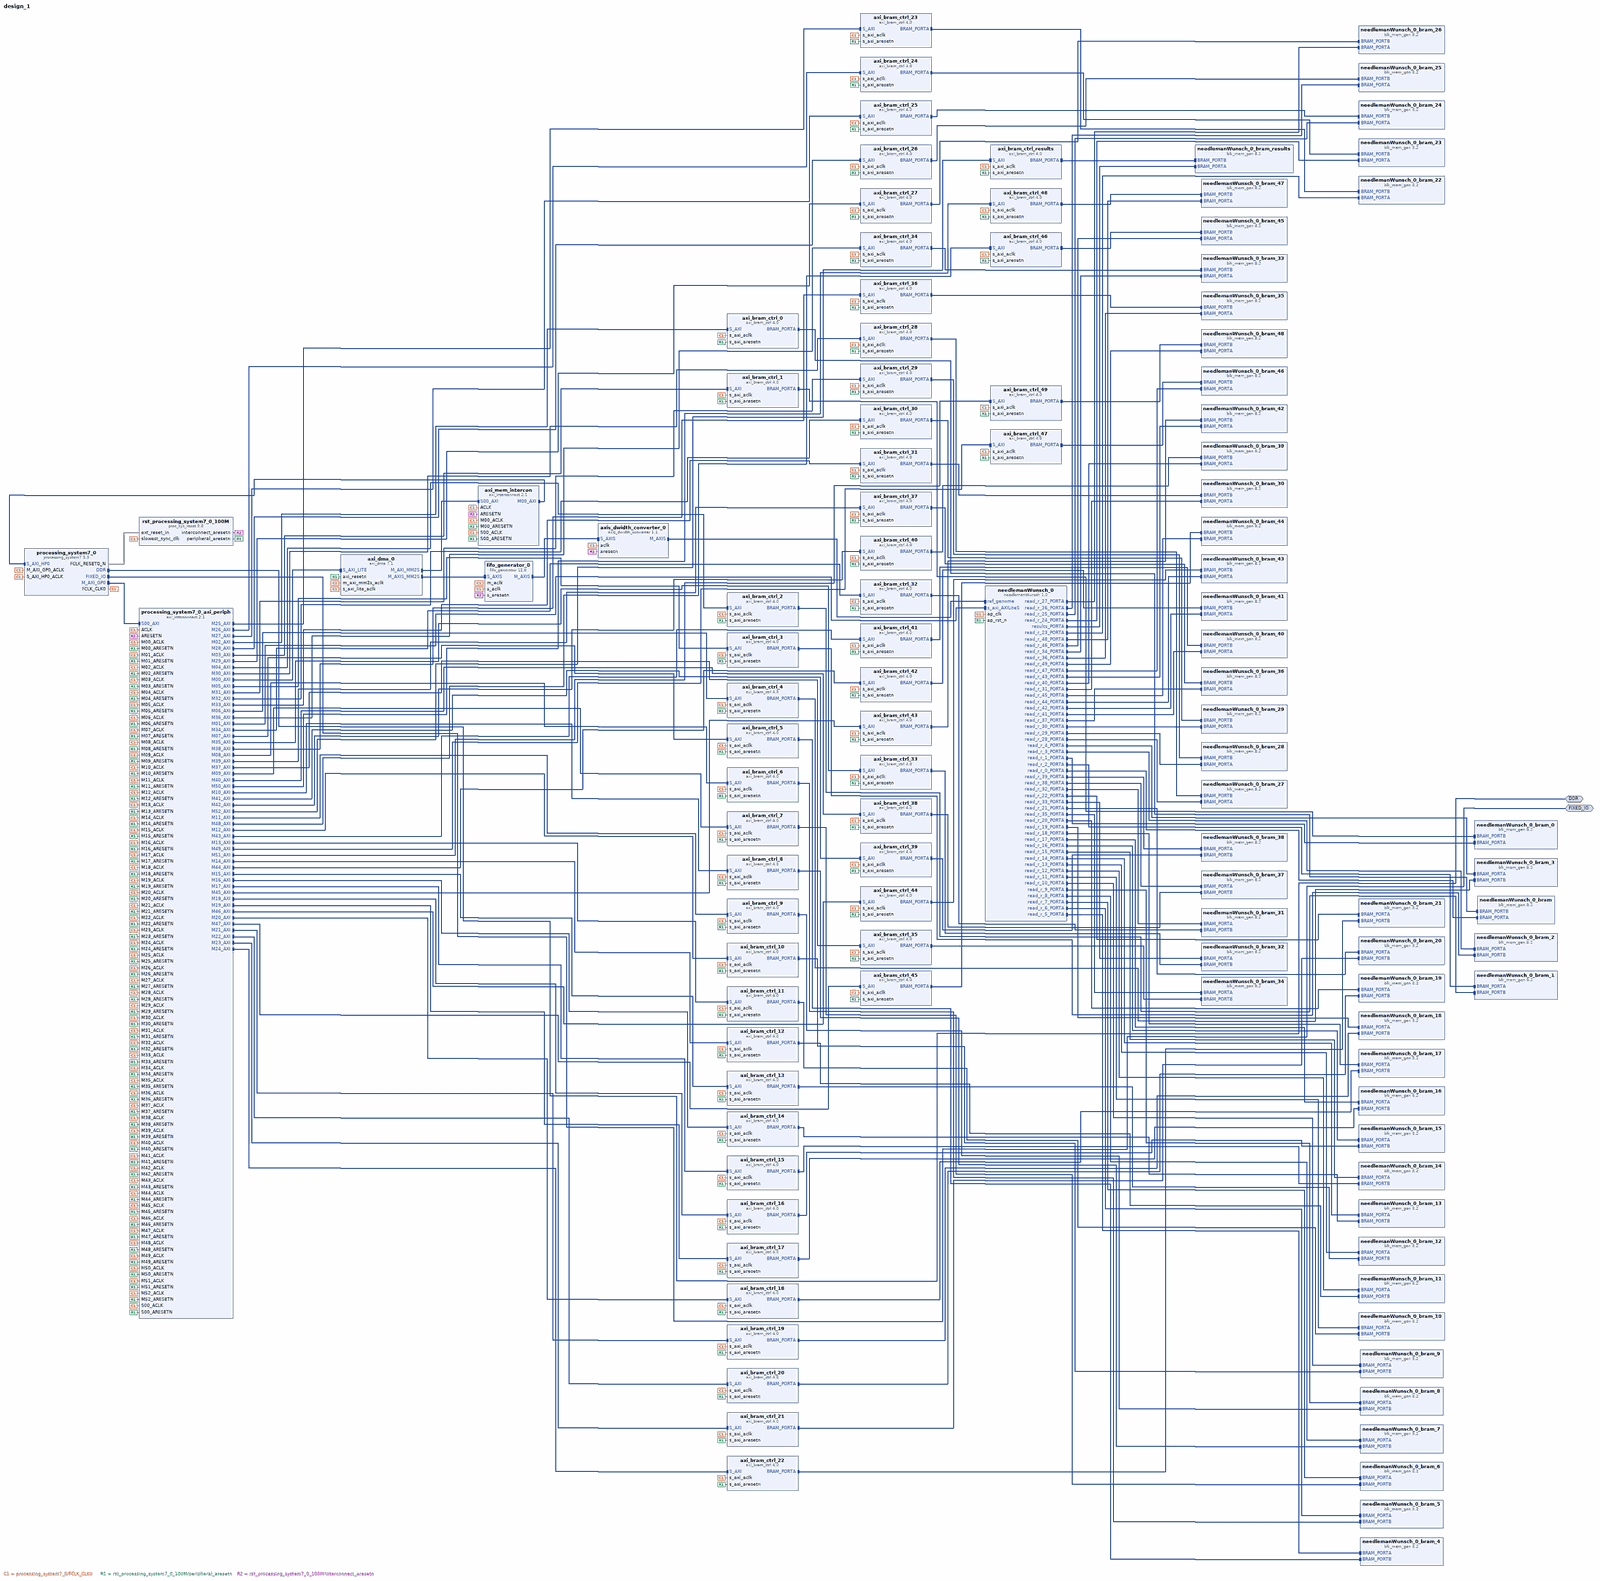
[diagram p0: block diagram of the top level, whole]
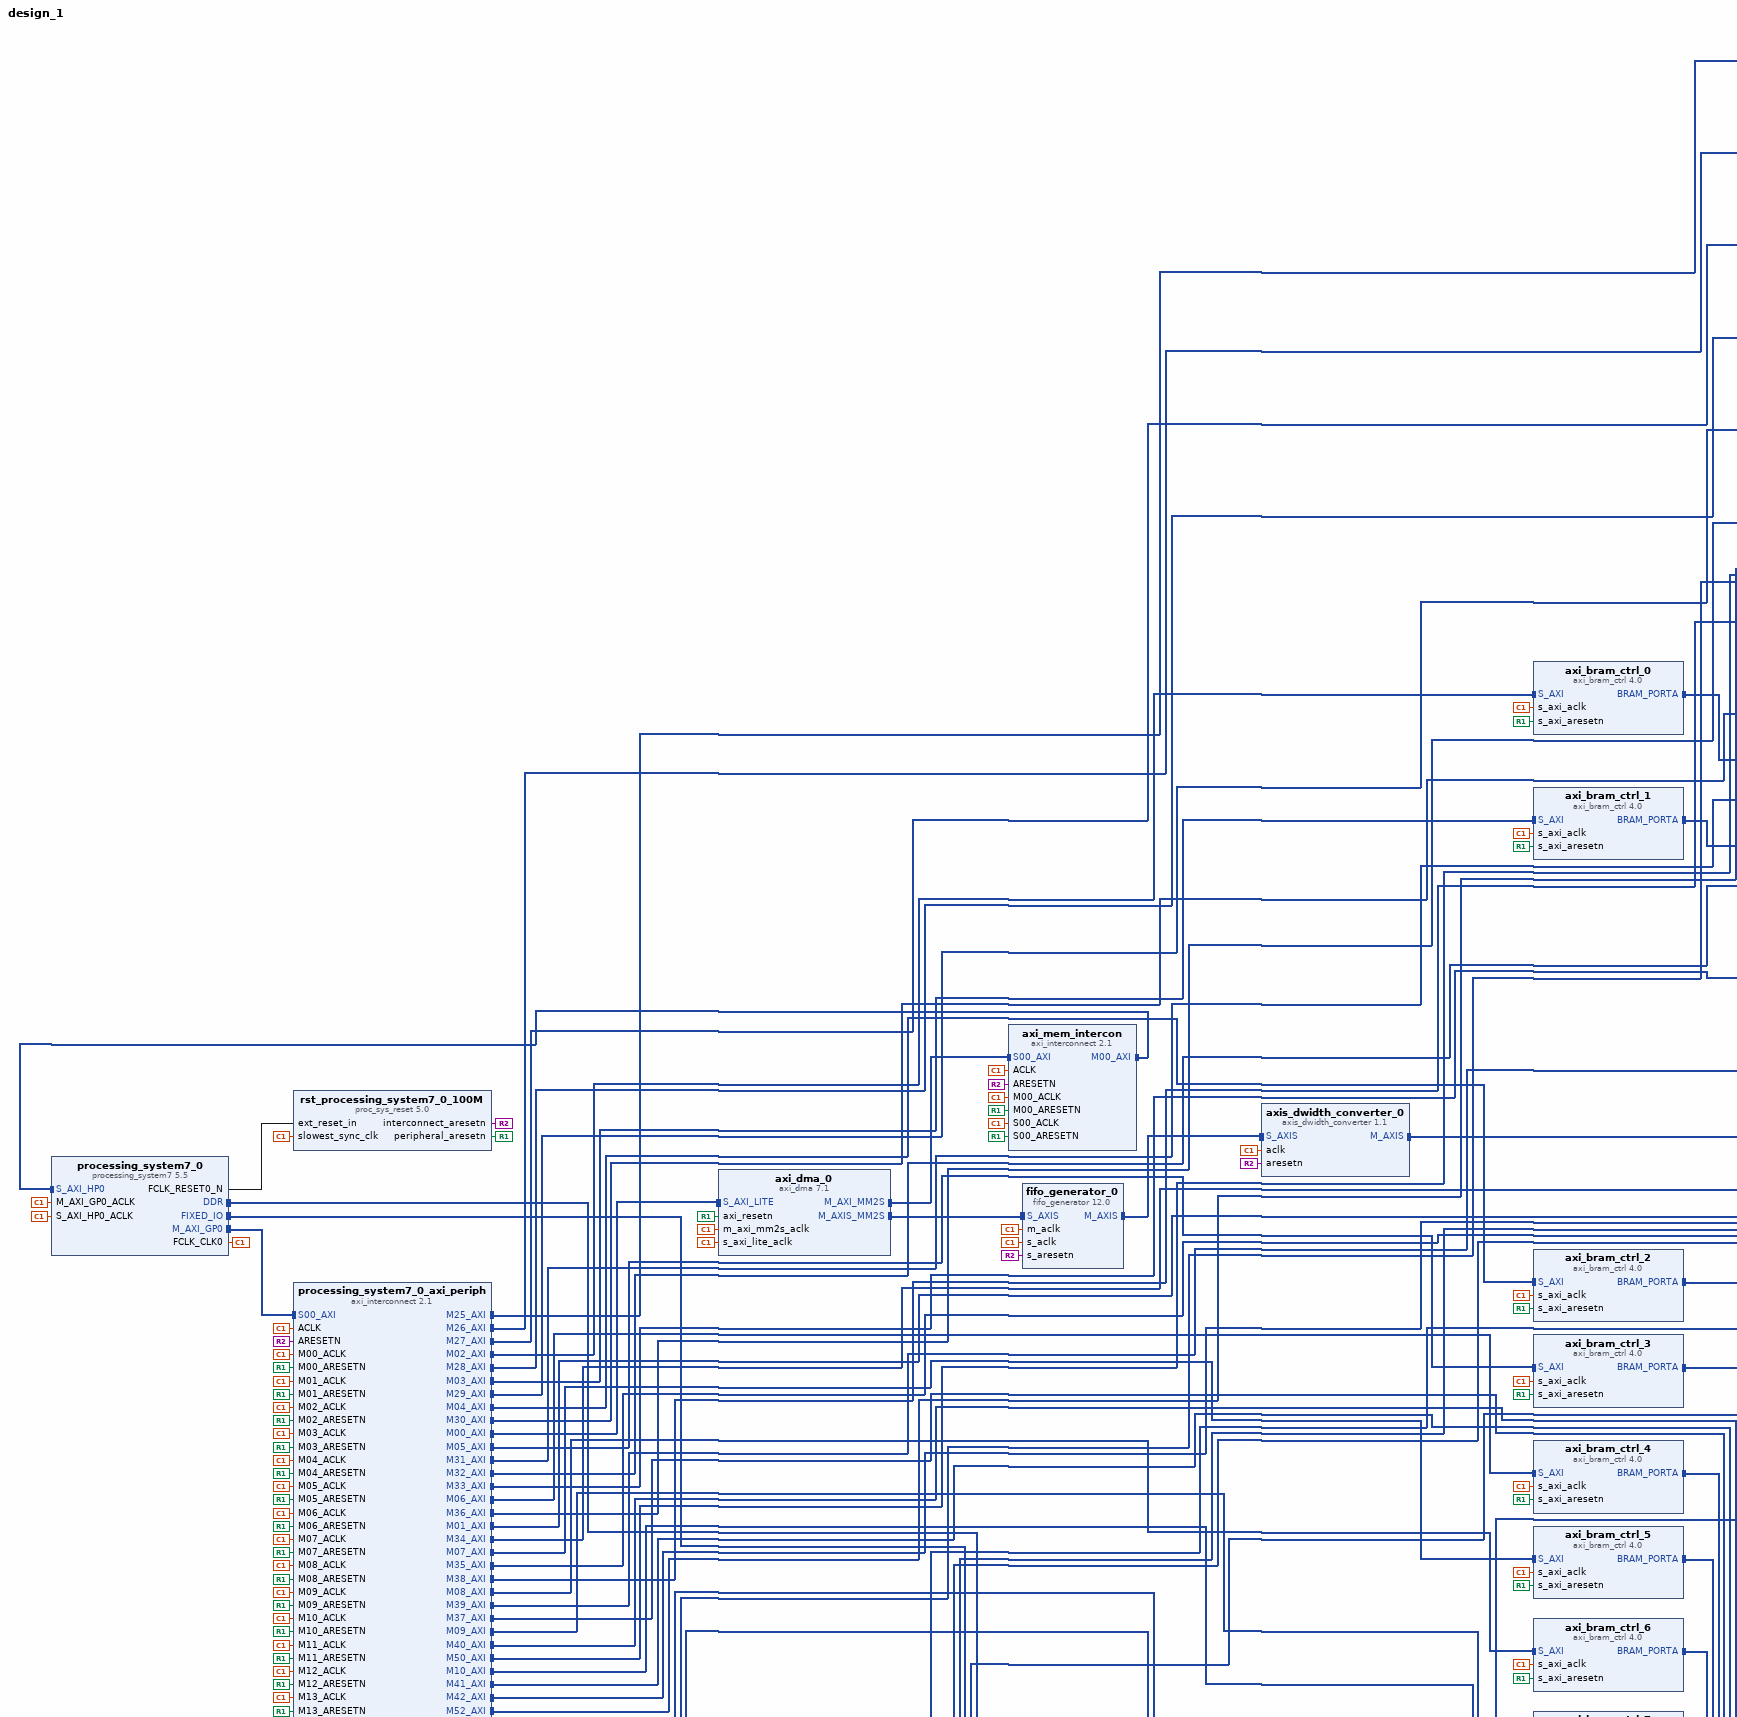
[diagram p1: block diagram of the top level, upper left part]
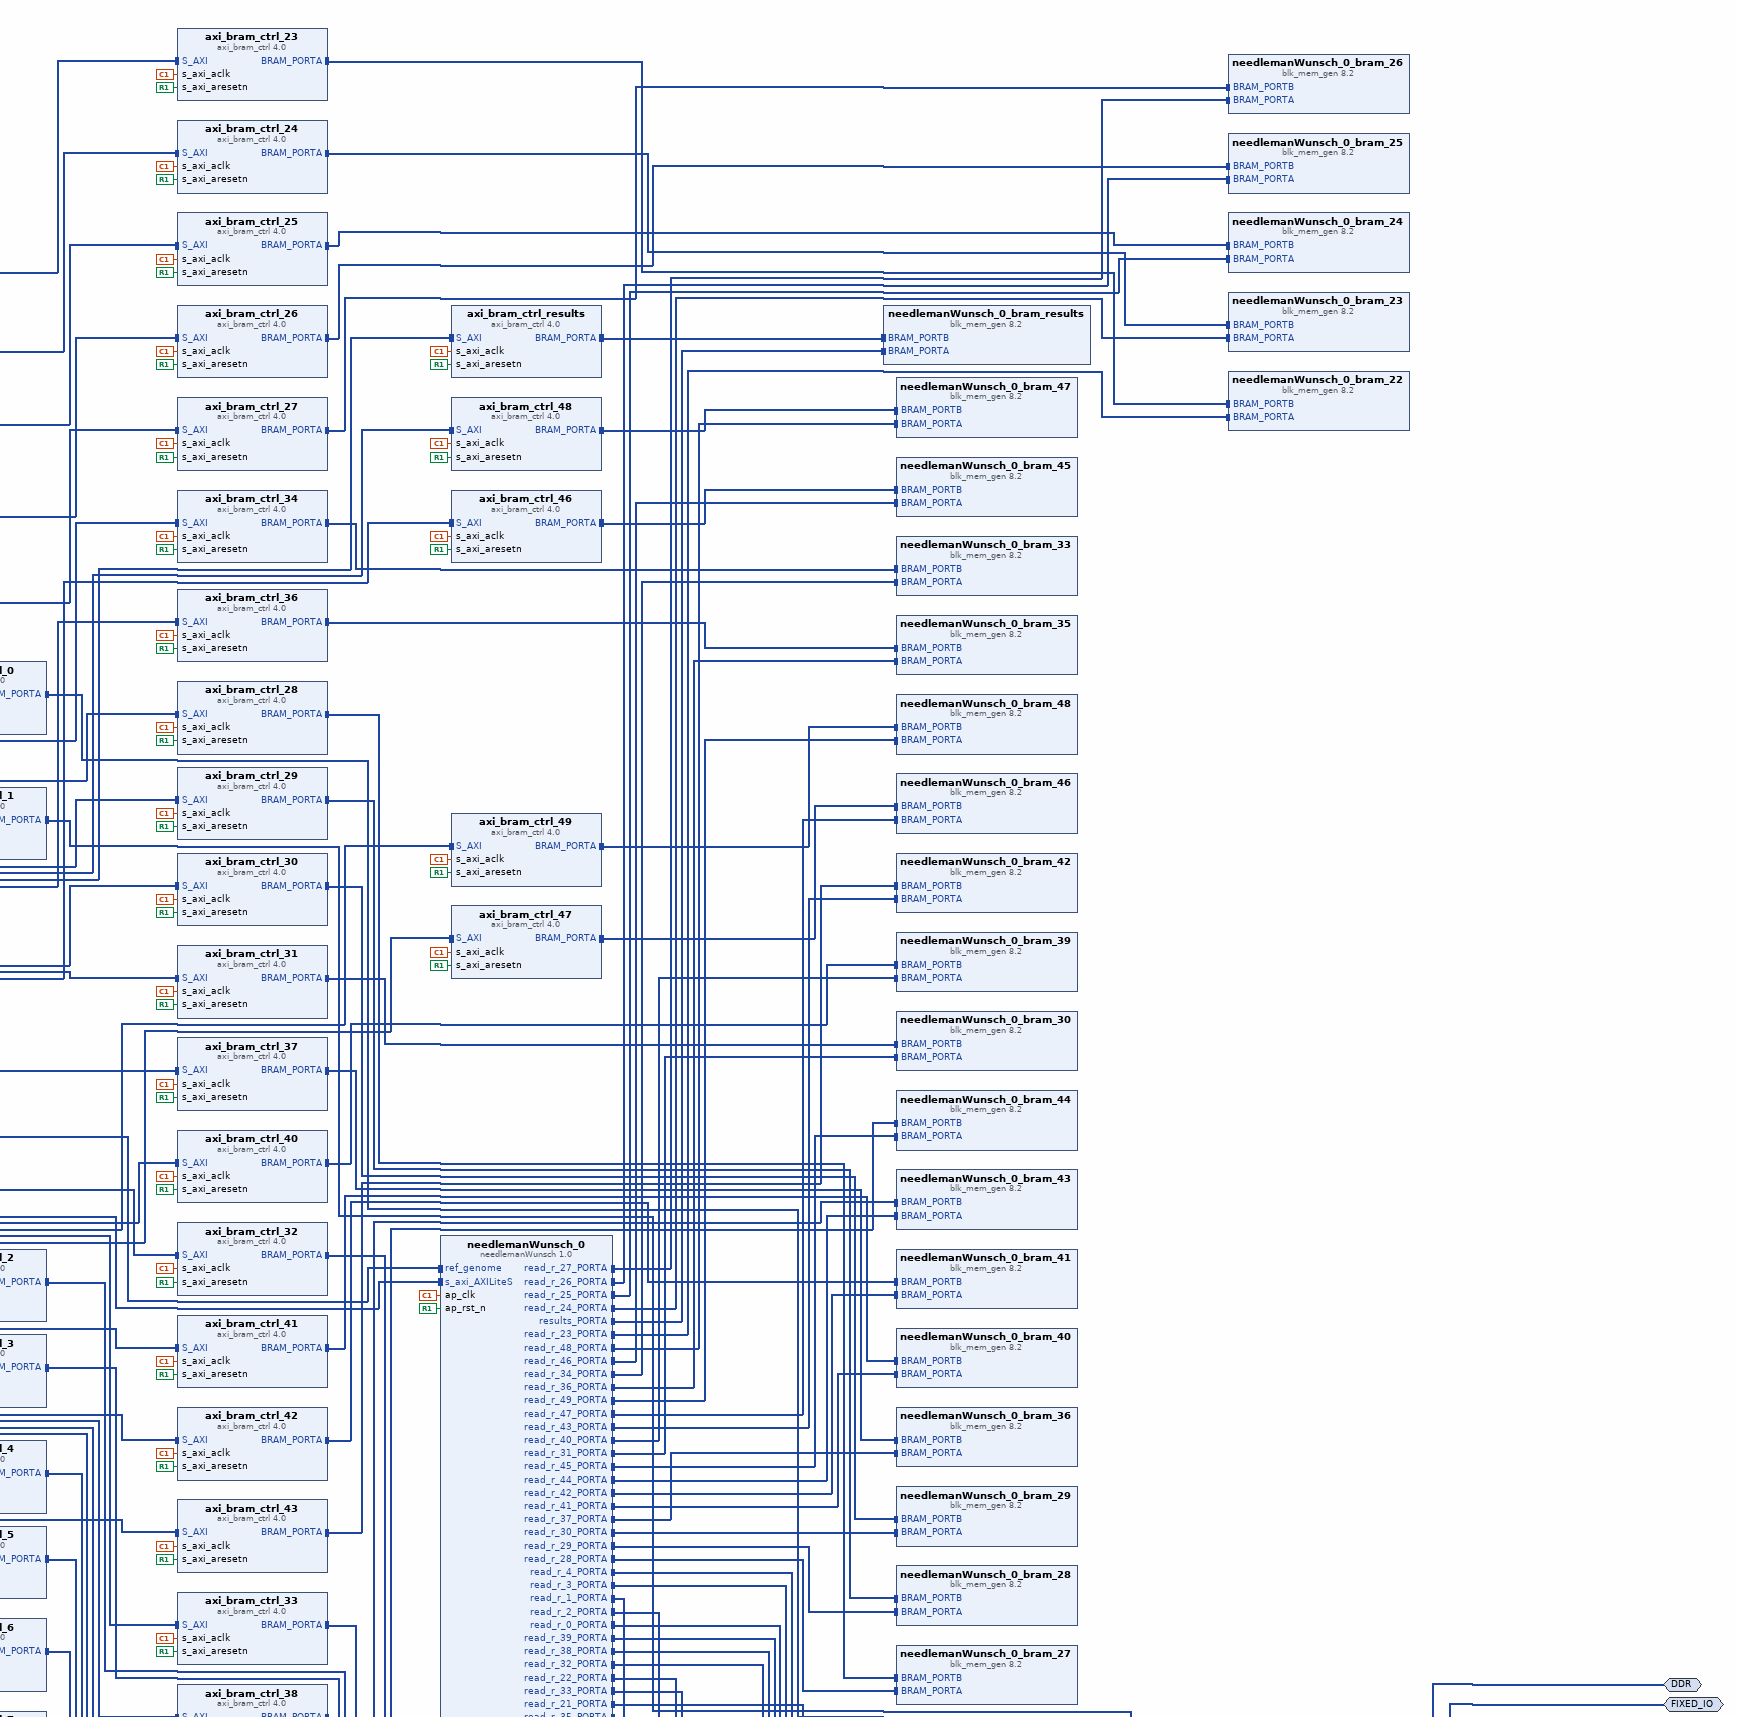
[diagram p2: block diagram of the top level, upper right part]
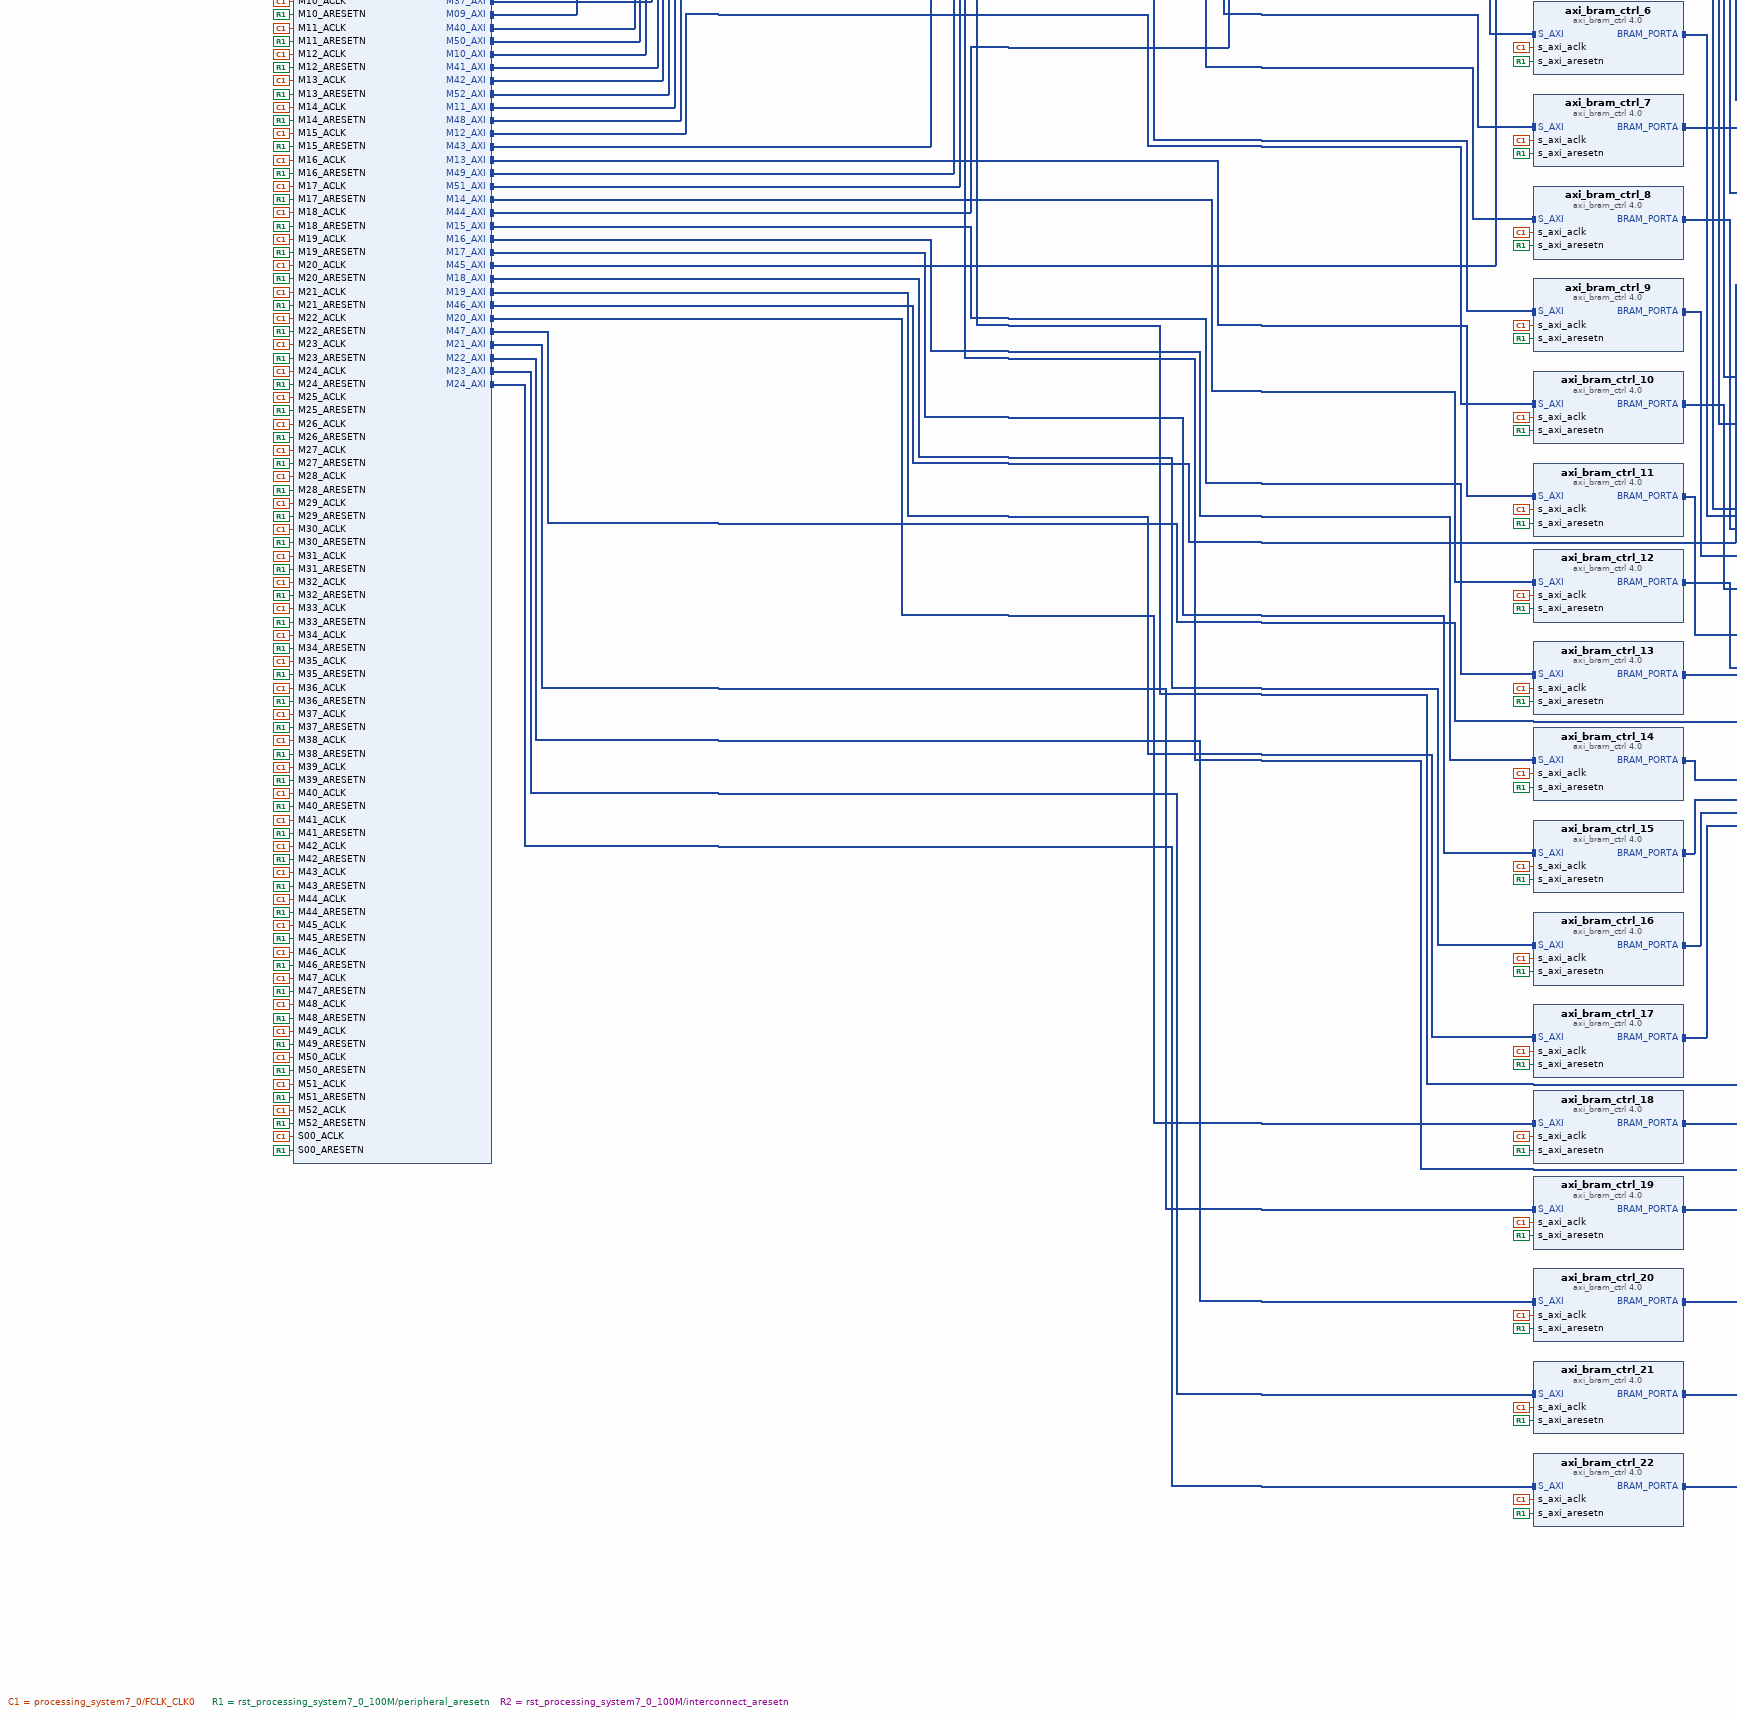
[diagram p3: block diagram of the top level, lower left part]
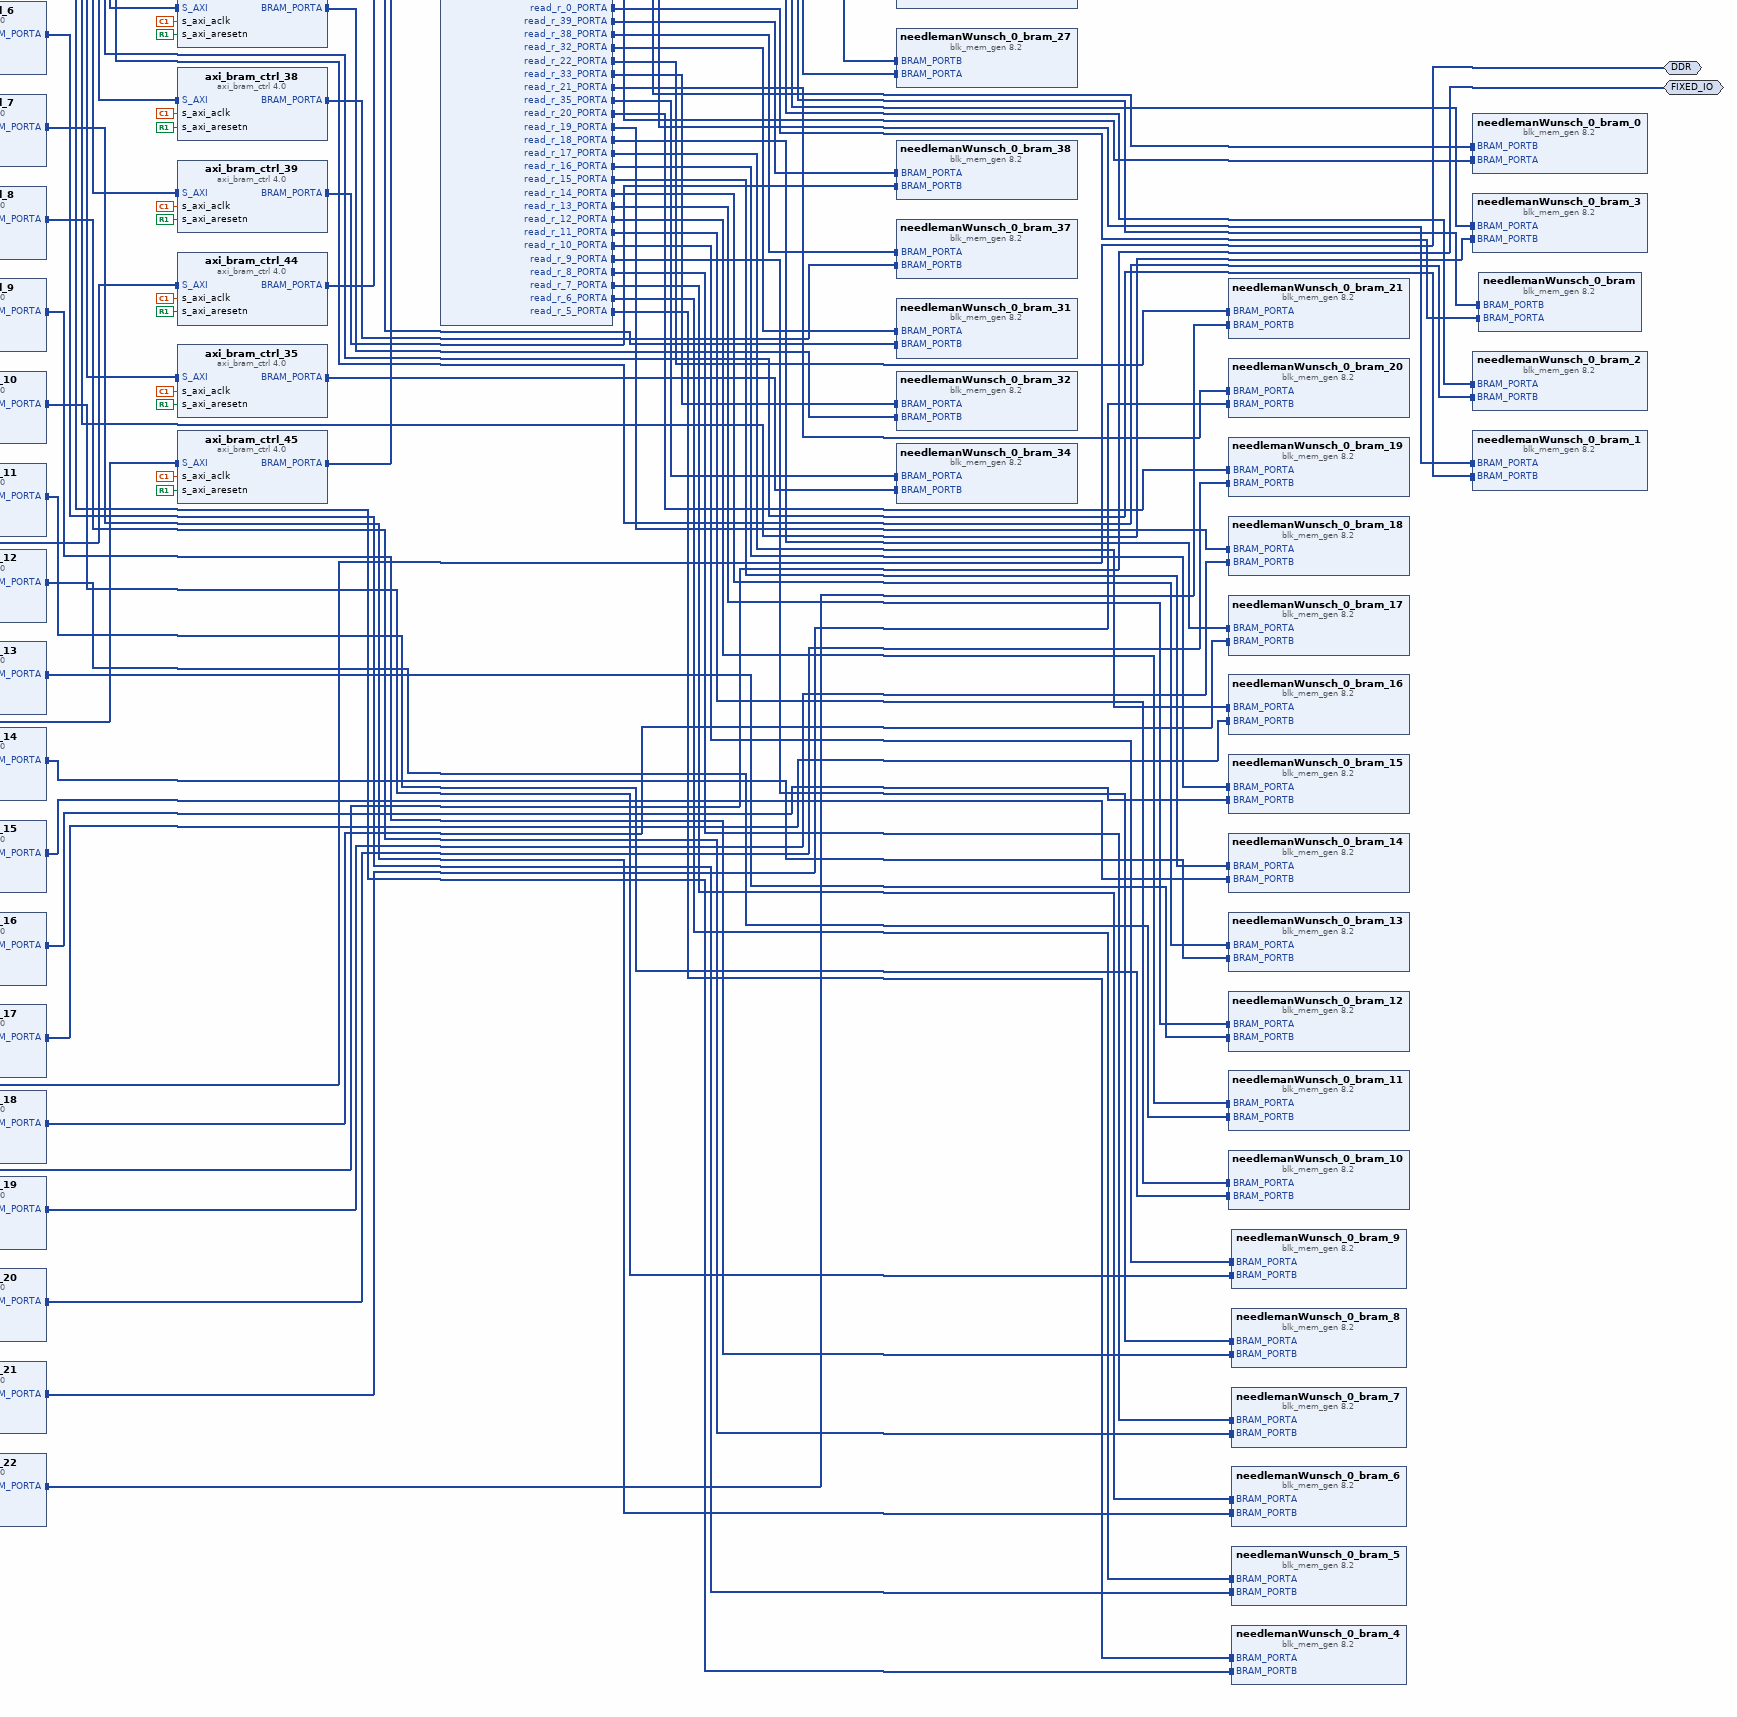
[diagram p4: block diagram of the top level, lower right part]
# Vivado block design design_1, Vivado 2015.2
create_bd_design design_1

create_bd_intf_port -mode Master -vlnv xilinx.com:interface:ddrx_rtl:1.0 DDR
create_bd_intf_port -mode Master -vlnv xilinx.com:display_processing_system7:fixedio_rtl:1.0 FIXED_IO

create_bd_cell -type ip -vlnv xilinx.com:ip:processing_system7:5.5 processing_system7_0
set_property -dict [list \
  CONFIG.PCW_FPGA1_PERIPHERAL_FREQMHZ 200 \
  CONFIG.PCW_USE_S_AXI_HP0 1 \
  CONFIG.PCW_EN_CLK1_PORT 1 \
  CONFIG.preset ZedBoard \
] [get_bd_cells processing_system7_0]
create_bd_cell -type ip -vlnv xilinx.com:ip:axi_dma:7.1 axi_dma_0
set_property -dict [list \
  CONFIG.c_include_sg 0 \
  CONFIG.c_sg_length_width 18 \
  CONFIG.c_m_axi_mm2s_data_width 64 \
  CONFIG.c_m_axis_mm2s_tdata_width 64 \
  CONFIG.c_mm2s_burst_size 8 \
  CONFIG.c_include_s2mm 0 \
] [get_bd_cells axi_dma_0]
create_bd_cell -type ip -vlnv xilinx.com:ip:fifo_generator:12.0 fifo_generator_0
set_property -dict [list \
  CONFIG.INTERFACE_TYPE AXI_STREAM \
  CONFIG.Clock_Type_AXI Independent_Clock \
  CONFIG.TDATA_NUM_BYTES 8 \
  CONFIG.TUSER_WIDTH 0 \
  CONFIG.FIFO_Implementation_wach Independent_Clocks_Distributed_RAM \
  CONFIG.FIFO_Implementation_wdch Independent_Clocks_Block_RAM \
  CONFIG.FIFO_Implementation_wrch Independent_Clocks_Distributed_RAM \
  CONFIG.FIFO_Implementation_rach Independent_Clocks_Distributed_RAM \
  CONFIG.FIFO_Implementation_rdch Independent_Clocks_Block_RAM \
  CONFIG.FIFO_Implementation_axis Independent_Clocks_Block_RAM \
] [get_bd_cells fifo_generator_0]
create_bd_cell -type ip -vlnv xilinx.com:ip:axis_dwidth_converter:1.1 axis_dwidth_converter_0
set_property -dict {CONFIG.M_TDATA_NUM_BYTES 1} [get_bd_cells axis_dwidth_converter_0]
create_bd_cell -type ip -vlnv xilinx.com:ip:axi_interconnect:2.1 axi_mem_intercon
set_property -dict {CONFIG.NUM_MI 1} [get_bd_cells axi_mem_intercon]
create_bd_cell -type ip -vlnv xilinx.com:ip:proc_sys_reset:5.0 rst_processing_system7_0_100M
create_bd_cell -type ip -vlnv xilinx.com:ip:axi_interconnect:2.1 processing_system7_0_axi_periph
set_property -dict {CONFIG.NUM_MI 53} [get_bd_cells processing_system7_0_axi_periph]
create_bd_cell -type ip -vlnv xilinx.com:ip:blk_mem_gen:8.2 needlemanWunsch_0_bram
set_property -dict [list \
  CONFIG.Memory_Type True_Dual_Port_RAM \
  CONFIG.Enable_B Use_ENB_Pin \
  CONFIG.Use_RSTB_Pin true \
  CONFIG.Port_B_Clock 100 \
  CONFIG.Port_B_Write_Rate 50 \
  CONFIG.Port_B_Enable_Rate 100 \
] [get_bd_cells needlemanWunsch_0_bram]
create_bd_cell -type ip -vlnv xilinx.com:ip:blk_mem_gen:8.2 needlemanWunsch_0_bram_0
set_property -dict [list \
  CONFIG.Memory_Type True_Dual_Port_RAM \
  CONFIG.Enable_B Use_ENB_Pin \
  CONFIG.Use_RSTB_Pin true \
  CONFIG.Port_B_Clock 100 \
  CONFIG.Port_B_Write_Rate 50 \
  CONFIG.Port_B_Enable_Rate 100 \
] [get_bd_cells needlemanWunsch_0_bram_0]
create_bd_cell -type ip -vlnv xilinx.com:ip:blk_mem_gen:8.2 needlemanWunsch_0_bram_1
set_property -dict [list \
  CONFIG.Memory_Type True_Dual_Port_RAM \
  CONFIG.Enable_B Use_ENB_Pin \
  CONFIG.Use_RSTB_Pin true \
  CONFIG.Port_B_Clock 100 \
  CONFIG.Port_B_Write_Rate 50 \
  CONFIG.Port_B_Enable_Rate 100 \
] [get_bd_cells needlemanWunsch_0_bram_1]
create_bd_cell -type ip -vlnv xilinx.com:ip:blk_mem_gen:8.2 needlemanWunsch_0_bram_2
set_property -dict [list \
  CONFIG.Memory_Type True_Dual_Port_RAM \
  CONFIG.Enable_B Use_ENB_Pin \
  CONFIG.Use_RSTB_Pin true \
  CONFIG.Port_B_Clock 100 \
  CONFIG.Port_B_Write_Rate 50 \
  CONFIG.Port_B_Enable_Rate 100 \
] [get_bd_cells needlemanWunsch_0_bram_2]
create_bd_cell -type ip -vlnv xilinx.com:ip:blk_mem_gen:8.2 needlemanWunsch_0_bram_3
set_property -dict [list \
  CONFIG.Memory_Type True_Dual_Port_RAM \
  CONFIG.Enable_B Use_ENB_Pin \
  CONFIG.Use_RSTB_Pin true \
  CONFIG.Port_B_Clock 100 \
  CONFIG.Port_B_Write_Rate 50 \
  CONFIG.Port_B_Enable_Rate 100 \
] [get_bd_cells needlemanWunsch_0_bram_3]
create_bd_cell -type ip -vlnv xilinx.com:ip:blk_mem_gen:8.2 needlemanWunsch_0_bram_4
set_property -dict [list \
  CONFIG.Memory_Type True_Dual_Port_RAM \
  CONFIG.Enable_B Use_ENB_Pin \
  CONFIG.Use_RSTB_Pin true \
  CONFIG.Port_B_Clock 100 \
  CONFIG.Port_B_Write_Rate 50 \
  CONFIG.Port_B_Enable_Rate 100 \
] [get_bd_cells needlemanWunsch_0_bram_4]
create_bd_cell -type ip -vlnv xilinx.com:ip:blk_mem_gen:8.2 needlemanWunsch_0_bram_5
set_property -dict [list \
  CONFIG.Memory_Type True_Dual_Port_RAM \
  CONFIG.Enable_B Use_ENB_Pin \
  CONFIG.Use_RSTB_Pin true \
  CONFIG.Port_B_Clock 100 \
  CONFIG.Port_B_Write_Rate 50 \
  CONFIG.Port_B_Enable_Rate 100 \
] [get_bd_cells needlemanWunsch_0_bram_5]
create_bd_cell -type ip -vlnv xilinx.com:ip:blk_mem_gen:8.2 needlemanWunsch_0_bram_6
set_property -dict [list \
  CONFIG.Memory_Type True_Dual_Port_RAM \
  CONFIG.Enable_B Use_ENB_Pin \
  CONFIG.Use_RSTB_Pin true \
  CONFIG.Port_B_Clock 100 \
  CONFIG.Port_B_Write_Rate 50 \
  CONFIG.Port_B_Enable_Rate 100 \
] [get_bd_cells needlemanWunsch_0_bram_6]
create_bd_cell -type ip -vlnv xilinx.com:ip:blk_mem_gen:8.2 needlemanWunsch_0_bram_7
set_property -dict [list \
  CONFIG.Memory_Type True_Dual_Port_RAM \
  CONFIG.Enable_B Use_ENB_Pin \
  CONFIG.Use_RSTB_Pin true \
  CONFIG.Port_B_Clock 100 \
  CONFIG.Port_B_Write_Rate 50 \
  CONFIG.Port_B_Enable_Rate 100 \
] [get_bd_cells needlemanWunsch_0_bram_7]
create_bd_cell -type ip -vlnv xilinx.com:ip:blk_mem_gen:8.2 needlemanWunsch_0_bram_8
set_property -dict [list \
  CONFIG.Memory_Type True_Dual_Port_RAM \
  CONFIG.Enable_B Use_ENB_Pin \
  CONFIG.Use_RSTB_Pin true \
  CONFIG.Port_B_Clock 100 \
  CONFIG.Port_B_Write_Rate 50 \
  CONFIG.Port_B_Enable_Rate 100 \
] [get_bd_cells needlemanWunsch_0_bram_8]
create_bd_cell -type ip -vlnv xilinx.com:ip:blk_mem_gen:8.2 needlemanWunsch_0_bram_9
set_property -dict [list \
  CONFIG.Memory_Type True_Dual_Port_RAM \
  CONFIG.Enable_B Use_ENB_Pin \
  CONFIG.Use_RSTB_Pin true \
  CONFIG.Port_B_Clock 100 \
  CONFIG.Port_B_Write_Rate 50 \
  CONFIG.Port_B_Enable_Rate 100 \
] [get_bd_cells needlemanWunsch_0_bram_9]
create_bd_cell -type ip -vlnv xilinx.com:ip:blk_mem_gen:8.2 needlemanWunsch_0_bram_10
set_property -dict [list \
  CONFIG.Memory_Type True_Dual_Port_RAM \
  CONFIG.Enable_B Use_ENB_Pin \
  CONFIG.Use_RSTB_Pin true \
  CONFIG.Port_B_Clock 100 \
  CONFIG.Port_B_Write_Rate 50 \
  CONFIG.Port_B_Enable_Rate 100 \
] [get_bd_cells needlemanWunsch_0_bram_10]
create_bd_cell -type ip -vlnv xilinx.com:ip:blk_mem_gen:8.2 needlemanWunsch_0_bram_11
set_property -dict [list \
  CONFIG.Memory_Type True_Dual_Port_RAM \
  CONFIG.Enable_B Use_ENB_Pin \
  CONFIG.Use_RSTB_Pin true \
  CONFIG.Port_B_Clock 100 \
  CONFIG.Port_B_Write_Rate 50 \
  CONFIG.Port_B_Enable_Rate 100 \
] [get_bd_cells needlemanWunsch_0_bram_11]
create_bd_cell -type ip -vlnv xilinx.com:ip:blk_mem_gen:8.2 needlemanWunsch_0_bram_12
set_property -dict [list \
  CONFIG.Memory_Type True_Dual_Port_RAM \
  CONFIG.Enable_B Use_ENB_Pin \
  CONFIG.Use_RSTB_Pin true \
  CONFIG.Port_B_Clock 100 \
  CONFIG.Port_B_Write_Rate 50 \
  CONFIG.Port_B_Enable_Rate 100 \
] [get_bd_cells needlemanWunsch_0_bram_12]
create_bd_cell -type ip -vlnv xilinx.com:ip:blk_mem_gen:8.2 needlemanWunsch_0_bram_13
set_property -dict [list \
  CONFIG.Memory_Type True_Dual_Port_RAM \
  CONFIG.Enable_B Use_ENB_Pin \
  CONFIG.Use_RSTB_Pin true \
  CONFIG.Port_B_Clock 100 \
  CONFIG.Port_B_Write_Rate 50 \
  CONFIG.Port_B_Enable_Rate 100 \
] [get_bd_cells needlemanWunsch_0_bram_13]
create_bd_cell -type ip -vlnv xilinx.com:ip:blk_mem_gen:8.2 needlemanWunsch_0_bram_14
set_property -dict [list \
  CONFIG.Memory_Type True_Dual_Port_RAM \
  CONFIG.Enable_B Use_ENB_Pin \
  CONFIG.Use_RSTB_Pin true \
  CONFIG.Port_B_Clock 100 \
  CONFIG.Port_B_Write_Rate 50 \
  CONFIG.Port_B_Enable_Rate 100 \
] [get_bd_cells needlemanWunsch_0_bram_14]
create_bd_cell -type ip -vlnv xilinx.com:ip:blk_mem_gen:8.2 needlemanWunsch_0_bram_15
set_property -dict [list \
  CONFIG.Memory_Type True_Dual_Port_RAM \
  CONFIG.Enable_B Use_ENB_Pin \
  CONFIG.Use_RSTB_Pin true \
  CONFIG.Port_B_Clock 100 \
  CONFIG.Port_B_Write_Rate 50 \
  CONFIG.Port_B_Enable_Rate 100 \
] [get_bd_cells needlemanWunsch_0_bram_15]
create_bd_cell -type ip -vlnv xilinx.com:ip:blk_mem_gen:8.2 needlemanWunsch_0_bram_16
set_property -dict [list \
  CONFIG.Memory_Type True_Dual_Port_RAM \
  CONFIG.Enable_B Use_ENB_Pin \
  CONFIG.Use_RSTB_Pin true \
  CONFIG.Port_B_Clock 100 \
  CONFIG.Port_B_Write_Rate 50 \
  CONFIG.Port_B_Enable_Rate 100 \
] [get_bd_cells needlemanWunsch_0_bram_16]
create_bd_cell -type ip -vlnv xilinx.com:ip:blk_mem_gen:8.2 needlemanWunsch_0_bram_17
set_property -dict [list \
  CONFIG.Memory_Type True_Dual_Port_RAM \
  CONFIG.Enable_B Use_ENB_Pin \
  CONFIG.Use_RSTB_Pin true \
  CONFIG.Port_B_Clock 100 \
  CONFIG.Port_B_Write_Rate 50 \
  CONFIG.Port_B_Enable_Rate 100 \
] [get_bd_cells needlemanWunsch_0_bram_17]
create_bd_cell -type ip -vlnv xilinx.com:ip:blk_mem_gen:8.2 needlemanWunsch_0_bram_18
set_property -dict [list \
  CONFIG.Memory_Type True_Dual_Port_RAM \
  CONFIG.Enable_B Use_ENB_Pin \
  CONFIG.Use_RSTB_Pin true \
  CONFIG.Port_B_Clock 100 \
  CONFIG.Port_B_Write_Rate 50 \
  CONFIG.Port_B_Enable_Rate 100 \
] [get_bd_cells needlemanWunsch_0_bram_18]
create_bd_cell -type ip -vlnv xilinx.com:ip:blk_mem_gen:8.2 needlemanWunsch_0_bram_19
set_property -dict [list \
  CONFIG.Memory_Type True_Dual_Port_RAM \
  CONFIG.Enable_B Use_ENB_Pin \
  CONFIG.Use_RSTB_Pin true \
  CONFIG.Port_B_Clock 100 \
  CONFIG.Port_B_Write_Rate 50 \
  CONFIG.Port_B_Enable_Rate 100 \
] [get_bd_cells needlemanWunsch_0_bram_19]
create_bd_cell -type ip -vlnv xilinx.com:ip:blk_mem_gen:8.2 needlemanWunsch_0_bram_20
set_property -dict [list \
  CONFIG.Memory_Type True_Dual_Port_RAM \
  CONFIG.Enable_B Use_ENB_Pin \
  CONFIG.Use_RSTB_Pin true \
  CONFIG.Port_B_Clock 100 \
  CONFIG.Port_B_Write_Rate 50 \
  CONFIG.Port_B_Enable_Rate 100 \
] [get_bd_cells needlemanWunsch_0_bram_20]
create_bd_cell -type ip -vlnv xilinx.com:ip:blk_mem_gen:8.2 needlemanWunsch_0_bram_21
set_property -dict [list \
  CONFIG.Memory_Type True_Dual_Port_RAM \
  CONFIG.Enable_B Use_ENB_Pin \
  CONFIG.Use_RSTB_Pin true \
  CONFIG.Port_B_Clock 100 \
  CONFIG.Port_B_Write_Rate 50 \
  CONFIG.Port_B_Enable_Rate 100 \
] [get_bd_cells needlemanWunsch_0_bram_21]
create_bd_cell -type ip -vlnv xilinx.com:ip:blk_mem_gen:8.2 needlemanWunsch_0_bram_22
set_property -dict [list \
  CONFIG.Memory_Type True_Dual_Port_RAM \
  CONFIG.Enable_B Use_ENB_Pin \
  CONFIG.Use_RSTB_Pin true \
  CONFIG.Port_B_Clock 100 \
  CONFIG.Port_B_Write_Rate 50 \
  CONFIG.Port_B_Enable_Rate 100 \
] [get_bd_cells needlemanWunsch_0_bram_22]
create_bd_cell -type ip -vlnv xilinx.com:ip:blk_mem_gen:8.2 needlemanWunsch_0_bram_23
set_property -dict [list \
  CONFIG.Memory_Type True_Dual_Port_RAM \
  CONFIG.Enable_B Use_ENB_Pin \
  CONFIG.Use_RSTB_Pin true \
  CONFIG.Port_B_Clock 100 \
  CONFIG.Port_B_Write_Rate 50 \
  CONFIG.Port_B_Enable_Rate 100 \
] [get_bd_cells needlemanWunsch_0_bram_23]
create_bd_cell -type ip -vlnv xilinx.com:ip:blk_mem_gen:8.2 needlemanWunsch_0_bram_24
set_property -dict [list \
  CONFIG.Memory_Type True_Dual_Port_RAM \
  CONFIG.Enable_B Use_ENB_Pin \
  CONFIG.Use_RSTB_Pin true \
  CONFIG.Port_B_Clock 100 \
  CONFIG.Port_B_Write_Rate 50 \
  CONFIG.Port_B_Enable_Rate 100 \
] [get_bd_cells needlemanWunsch_0_bram_24]
create_bd_cell -type ip -vlnv xilinx.com:ip:blk_mem_gen:8.2 needlemanWunsch_0_bram_25
set_property -dict [list \
  CONFIG.Memory_Type True_Dual_Port_RAM \
  CONFIG.Enable_B Use_ENB_Pin \
  CONFIG.Use_RSTB_Pin true \
  CONFIG.Port_B_Clock 100 \
  CONFIG.Port_B_Write_Rate 50 \
  CONFIG.Port_B_Enable_Rate 100 \
] [get_bd_cells needlemanWunsch_0_bram_25]
create_bd_cell -type ip -vlnv xilinx.com:ip:blk_mem_gen:8.2 needlemanWunsch_0_bram_26
set_property -dict [list \
  CONFIG.Memory_Type True_Dual_Port_RAM \
  CONFIG.Enable_B Use_ENB_Pin \
  CONFIG.Use_RSTB_Pin true \
  CONFIG.Port_B_Clock 100 \
  CONFIG.Port_B_Write_Rate 50 \
  CONFIG.Port_B_Enable_Rate 100 \
] [get_bd_cells needlemanWunsch_0_bram_26]
create_bd_cell -type ip -vlnv xilinx.com:ip:blk_mem_gen:8.2 needlemanWunsch_0_bram_27
set_property -dict [list \
  CONFIG.Memory_Type True_Dual_Port_RAM \
  CONFIG.Enable_B Use_ENB_Pin \
  CONFIG.Use_RSTB_Pin true \
  CONFIG.Port_B_Clock 100 \
  CONFIG.Port_B_Write_Rate 50 \
  CONFIG.Port_B_Enable_Rate 100 \
] [get_bd_cells needlemanWunsch_0_bram_27]
create_bd_cell -type ip -vlnv xilinx.com:ip:blk_mem_gen:8.2 needlemanWunsch_0_bram_28
set_property -dict [list \
  CONFIG.Memory_Type True_Dual_Port_RAM \
  CONFIG.Enable_B Use_ENB_Pin \
  CONFIG.Use_RSTB_Pin true \
  CONFIG.Port_B_Clock 100 \
  CONFIG.Port_B_Write_Rate 50 \
  CONFIG.Port_B_Enable_Rate 100 \
] [get_bd_cells needlemanWunsch_0_bram_28]
create_bd_cell -type ip -vlnv xilinx.com:ip:blk_mem_gen:8.2 needlemanWunsch_0_bram_29
set_property -dict [list \
  CONFIG.Memory_Type True_Dual_Port_RAM \
  CONFIG.Enable_B Use_ENB_Pin \
  CONFIG.Use_RSTB_Pin true \
  CONFIG.Port_B_Clock 100 \
  CONFIG.Port_B_Write_Rate 50 \
  CONFIG.Port_B_Enable_Rate 100 \
] [get_bd_cells needlemanWunsch_0_bram_29]
create_bd_cell -type ip -vlnv xilinx.com:ip:blk_mem_gen:8.2 needlemanWunsch_0_bram_30
set_property -dict [list \
  CONFIG.Memory_Type True_Dual_Port_RAM \
  CONFIG.Enable_B Use_ENB_Pin \
  CONFIG.Use_RSTB_Pin true \
  CONFIG.Port_B_Clock 100 \
  CONFIG.Port_B_Write_Rate 50 \
  CONFIG.Port_B_Enable_Rate 100 \
] [get_bd_cells needlemanWunsch_0_bram_30]
create_bd_cell -type ip -vlnv xilinx.com:ip:blk_mem_gen:8.2 needlemanWunsch_0_bram_31
set_property -dict [list \
  CONFIG.Memory_Type True_Dual_Port_RAM \
  CONFIG.Enable_B Use_ENB_Pin \
  CONFIG.Use_RSTB_Pin true \
  CONFIG.Port_B_Clock 100 \
  CONFIG.Port_B_Write_Rate 50 \
  CONFIG.Port_B_Enable_Rate 100 \
] [get_bd_cells needlemanWunsch_0_bram_31]
create_bd_cell -type ip -vlnv xilinx.com:ip:blk_mem_gen:8.2 needlemanWunsch_0_bram_32
set_property -dict [list \
  CONFIG.Memory_Type True_Dual_Port_RAM \
  CONFIG.Enable_B Use_ENB_Pin \
  CONFIG.Use_RSTB_Pin true \
  CONFIG.Port_B_Clock 100 \
  CONFIG.Port_B_Write_Rate 50 \
  CONFIG.Port_B_Enable_Rate 100 \
] [get_bd_cells needlemanWunsch_0_bram_32]
create_bd_cell -type ip -vlnv xilinx.com:ip:blk_mem_gen:8.2 needlemanWunsch_0_bram_33
set_property -dict [list \
  CONFIG.Memory_Type True_Dual_Port_RAM \
  CONFIG.Enable_B Use_ENB_Pin \
  CONFIG.Use_RSTB_Pin true \
  CONFIG.Port_B_Clock 100 \
  CONFIG.Port_B_Write_Rate 50 \
  CONFIG.Port_B_Enable_Rate 100 \
] [get_bd_cells needlemanWunsch_0_bram_33]
create_bd_cell -type ip -vlnv xilinx.com:ip:blk_mem_gen:8.2 needlemanWunsch_0_bram_34
set_property -dict [list \
  CONFIG.Memory_Type True_Dual_Port_RAM \
  CONFIG.Enable_B Use_ENB_Pin \
  CONFIG.Use_RSTB_Pin true \
  CONFIG.Port_B_Clock 100 \
  CONFIG.Port_B_Write_Rate 50 \
  CONFIG.Port_B_Enable_Rate 100 \
] [get_bd_cells needlemanWunsch_0_bram_34]
create_bd_cell -type ip -vlnv xilinx.com:ip:blk_mem_gen:8.2 needlemanWunsch_0_bram_35
set_property -dict [list \
  CONFIG.Memory_Type True_Dual_Port_RAM \
  CONFIG.Enable_B Use_ENB_Pin \
  CONFIG.Use_RSTB_Pin true \
  CONFIG.Port_B_Clock 100 \
  CONFIG.Port_B_Write_Rate 50 \
  CONFIG.Port_B_Enable_Rate 100 \
] [get_bd_cells needlemanWunsch_0_bram_35]
create_bd_cell -type ip -vlnv xilinx.com:ip:blk_mem_gen:8.2 needlemanWunsch_0_bram_36
set_property -dict [list \
  CONFIG.Memory_Type True_Dual_Port_RAM \
  CONFIG.Enable_B Use_ENB_Pin \
  CONFIG.Use_RSTB_Pin true \
  CONFIG.Port_B_Clock 100 \
  CONFIG.Port_B_Write_Rate 50 \
  CONFIG.Port_B_Enable_Rate 100 \
] [get_bd_cells needlemanWunsch_0_bram_36]
create_bd_cell -type ip -vlnv xilinx.com:ip:blk_mem_gen:8.2 needlemanWunsch_0_bram_37
set_property -dict [list \
  CONFIG.Memory_Type True_Dual_Port_RAM \
  CONFIG.Enable_B Use_ENB_Pin \
  CONFIG.Use_RSTB_Pin true \
  CONFIG.Port_B_Clock 100 \
  CONFIG.Port_B_Write_Rate 50 \
  CONFIG.Port_B_Enable_Rate 100 \
] [get_bd_cells needlemanWunsch_0_bram_37]
create_bd_cell -type ip -vlnv xilinx.com:ip:blk_mem_gen:8.2 needlemanWunsch_0_bram_38
set_property -dict [list \
  CONFIG.Memory_Type True_Dual_Port_RAM \
  CONFIG.Enable_B Use_ENB_Pin \
  CONFIG.Use_RSTB_Pin true \
  CONFIG.Port_B_Clock 100 \
  CONFIG.Port_B_Write_Rate 50 \
  CONFIG.Port_B_Enable_Rate 100 \
] [get_bd_cells needlemanWunsch_0_bram_38]
create_bd_cell -type ip -vlnv xilinx.com:ip:blk_mem_gen:8.2 needlemanWunsch_0_bram_39
set_property -dict [list \
  CONFIG.Memory_Type True_Dual_Port_RAM \
  CONFIG.Enable_B Use_ENB_Pin \
  CONFIG.Use_RSTB_Pin true \
  CONFIG.Port_B_Clock 100 \
  CONFIG.Port_B_Write_Rate 50 \
  CONFIG.Port_B_Enable_Rate 100 \
] [get_bd_cells needlemanWunsch_0_bram_39]
create_bd_cell -type ip -vlnv xilinx.com:ip:blk_mem_gen:8.2 needlemanWunsch_0_bram_40
set_property -dict [list \
  CONFIG.Memory_Type True_Dual_Port_RAM \
  CONFIG.Enable_B Use_ENB_Pin \
  CONFIG.Use_RSTB_Pin true \
  CONFIG.Port_B_Clock 100 \
  CONFIG.Port_B_Write_Rate 50 \
  CONFIG.Port_B_Enable_Rate 100 \
] [get_bd_cells needlemanWunsch_0_bram_40]
create_bd_cell -type ip -vlnv xilinx.com:ip:blk_mem_gen:8.2 needlemanWunsch_0_bram_41
set_property -dict [list \
  CONFIG.Memory_Type True_Dual_Port_RAM \
  CONFIG.Enable_B Use_ENB_Pin \
  CONFIG.Use_RSTB_Pin true \
  CONFIG.Port_B_Clock 100 \
  CONFIG.Port_B_Write_Rate 50 \
  CONFIG.Port_B_Enable_Rate 100 \
] [get_bd_cells needlemanWunsch_0_bram_41]
create_bd_cell -type ip -vlnv xilinx.com:ip:blk_mem_gen:8.2 needlemanWunsch_0_bram_42
set_property -dict [list \
  CONFIG.Memory_Type True_Dual_Port_RAM \
  CONFIG.Enable_B Use_ENB_Pin \
  CONFIG.Use_RSTB_Pin true \
  CONFIG.Port_B_Clock 100 \
  CONFIG.Port_B_Write_Rate 50 \
  CONFIG.Port_B_Enable_Rate 100 \
] [get_bd_cells needlemanWunsch_0_bram_42]
create_bd_cell -type ip -vlnv xilinx.com:ip:blk_mem_gen:8.2 needlemanWunsch_0_bram_43
set_property -dict [list \
  CONFIG.Memory_Type True_Dual_Port_RAM \
  CONFIG.Enable_B Use_ENB_Pin \
  CONFIG.Use_RSTB_Pin true \
  CONFIG.Port_B_Clock 100 \
  CONFIG.Port_B_Write_Rate 50 \
  CONFIG.Port_B_Enable_Rate 100 \
] [get_bd_cells needlemanWunsch_0_bram_43]
create_bd_cell -type ip -vlnv xilinx.com:ip:blk_mem_gen:8.2 needlemanWunsch_0_bram_44
set_property -dict [list \
  CONFIG.Memory_Type True_Dual_Port_RAM \
  CONFIG.Enable_B Use_ENB_Pin \
  CONFIG.Use_RSTB_Pin true \
  CONFIG.Port_B_Clock 100 \
  CONFIG.Port_B_Write_Rate 50 \
  CONFIG.Port_B_Enable_Rate 100 \
] [get_bd_cells needlemanWunsch_0_bram_44]
create_bd_cell -type ip -vlnv xilinx.com:ip:blk_mem_gen:8.2 needlemanWunsch_0_bram_45
set_property -dict [list \
  CONFIG.Memory_Type True_Dual_Port_RAM \
  CONFIG.Enable_B Use_ENB_Pin \
  CONFIG.Use_RSTB_Pin true \
  CONFIG.Port_B_Clock 100 \
  CONFIG.Port_B_Write_Rate 50 \
  CONFIG.Port_B_Enable_Rate 100 \
] [get_bd_cells needlemanWunsch_0_bram_45]
create_bd_cell -type ip -vlnv xilinx.com:ip:blk_mem_gen:8.2 needlemanWunsch_0_bram_46
set_property -dict [list \
  CONFIG.Memory_Type True_Dual_Port_RAM \
  CONFIG.Enable_B Use_ENB_Pin \
  CONFIG.Use_RSTB_Pin true \
  CONFIG.Port_B_Clock 100 \
  CONFIG.Port_B_Write_Rate 50 \
  CONFIG.Port_B_Enable_Rate 100 \
] [get_bd_cells needlemanWunsch_0_bram_46]
create_bd_cell -type ip -vlnv xilinx.com:ip:blk_mem_gen:8.2 needlemanWunsch_0_bram_47
set_property -dict [list \
  CONFIG.Memory_Type True_Dual_Port_RAM \
  CONFIG.Enable_B Use_ENB_Pin \
  CONFIG.Use_RSTB_Pin true \
  CONFIG.Port_B_Clock 100 \
  CONFIG.Port_B_Write_Rate 50 \
  CONFIG.Port_B_Enable_Rate 100 \
] [get_bd_cells needlemanWunsch_0_bram_47]
create_bd_cell -type ip -vlnv xilinx.com:ip:blk_mem_gen:8.2 needlemanWunsch_0_bram_48
set_property -dict [list \
  CONFIG.Memory_Type True_Dual_Port_RAM \
  CONFIG.Enable_B Use_ENB_Pin \
  CONFIG.Use_RSTB_Pin true \
  CONFIG.Port_B_Clock 100 \
  CONFIG.Port_B_Write_Rate 50 \
  CONFIG.Port_B_Enable_Rate 100 \
] [get_bd_cells needlemanWunsch_0_bram_48]
create_bd_cell -type ip -vlnv xilinx.com:ip:axi_bram_ctrl:4.0 axi_bram_ctrl_0
set_property -dict {CONFIG.PROTOCOL AXI4LITE CONFIG.SINGLE_PORT_BRAM 1} [get_bd_cells axi_bram_ctrl_0]
create_bd_cell -type ip -vlnv xilinx.com:ip:axi_bram_ctrl:4.0 axi_bram_ctrl_1
set_property -dict {CONFIG.PROTOCOL AXI4LITE CONFIG.SINGLE_PORT_BRAM 1} [get_bd_cells axi_bram_ctrl_1]
create_bd_cell -type ip -vlnv xilinx.com:ip:axi_bram_ctrl:4.0 axi_bram_ctrl_2
set_property -dict {CONFIG.PROTOCOL AXI4LITE CONFIG.SINGLE_PORT_BRAM 1} [get_bd_cells axi_bram_ctrl_2]
create_bd_cell -type ip -vlnv xilinx.com:ip:axi_bram_ctrl:4.0 axi_bram_ctrl_3
set_property -dict {CONFIG.PROTOCOL AXI4LITE CONFIG.SINGLE_PORT_BRAM 1} [get_bd_cells axi_bram_ctrl_3]
create_bd_cell -type ip -vlnv xilinx.com:ip:axi_bram_ctrl:4.0 axi_bram_ctrl_4
set_property -dict {CONFIG.PROTOCOL AXI4LITE CONFIG.SINGLE_PORT_BRAM 1} [get_bd_cells axi_bram_ctrl_4]
create_bd_cell -type ip -vlnv xilinx.com:ip:axi_bram_ctrl:4.0 axi_bram_ctrl_5
set_property -dict {CONFIG.PROTOCOL AXI4LITE CONFIG.SINGLE_PORT_BRAM 1} [get_bd_cells axi_bram_ctrl_5]
create_bd_cell -type ip -vlnv xilinx.com:ip:axi_bram_ctrl:4.0 axi_bram_ctrl_6
set_property -dict {CONFIG.PROTOCOL AXI4LITE CONFIG.SINGLE_PORT_BRAM 1} [get_bd_cells axi_bram_ctrl_6]
create_bd_cell -type ip -vlnv xilinx.com:ip:axi_bram_ctrl:4.0 axi_bram_ctrl_7
set_property -dict {CONFIG.PROTOCOL AXI4LITE CONFIG.SINGLE_PORT_BRAM 1} [get_bd_cells axi_bram_ctrl_7]
create_bd_cell -type ip -vlnv xilinx.com:ip:axi_bram_ctrl:4.0 axi_bram_ctrl_8
set_property -dict {CONFIG.PROTOCOL AXI4LITE CONFIG.SINGLE_PORT_BRAM 1} [get_bd_cells axi_bram_ctrl_8]
create_bd_cell -type ip -vlnv xilinx.com:ip:axi_bram_ctrl:4.0 axi_bram_ctrl_9
set_property -dict {CONFIG.PROTOCOL AXI4LITE CONFIG.SINGLE_PORT_BRAM 1} [get_bd_cells axi_bram_ctrl_9]
create_bd_cell -type ip -vlnv xilinx.com:ip:axi_bram_ctrl:4.0 axi_bram_ctrl_10
set_property -dict {CONFIG.PROTOCOL AXI4LITE CONFIG.SINGLE_PORT_BRAM 1} [get_bd_cells axi_bram_ctrl_10]
create_bd_cell -type ip -vlnv xilinx.com:ip:axi_bram_ctrl:4.0 axi_bram_ctrl_11
set_property -dict {CONFIG.PROTOCOL AXI4LITE CONFIG.SINGLE_PORT_BRAM 1} [get_bd_cells axi_bram_ctrl_11]
create_bd_cell -type ip -vlnv xilinx.com:ip:axi_bram_ctrl:4.0 axi_bram_ctrl_12
set_property -dict {CONFIG.PROTOCOL AXI4LITE CONFIG.SINGLE_PORT_BRAM 1} [get_bd_cells axi_bram_ctrl_12]
create_bd_cell -type ip -vlnv xilinx.com:ip:axi_bram_ctrl:4.0 axi_bram_ctrl_13
set_property -dict {CONFIG.PROTOCOL AXI4LITE CONFIG.SINGLE_PORT_BRAM 1} [get_bd_cells axi_bram_ctrl_13]
create_bd_cell -type ip -vlnv xilinx.com:ip:axi_bram_ctrl:4.0 axi_bram_ctrl_14
set_property -dict {CONFIG.PROTOCOL AXI4LITE CONFIG.SINGLE_PORT_BRAM 1} [get_bd_cells axi_bram_ctrl_14]
create_bd_cell -type ip -vlnv xilinx.com:ip:axi_bram_ctrl:4.0 axi_bram_ctrl_15
set_property -dict {CONFIG.PROTOCOL AXI4LITE CONFIG.SINGLE_PORT_BRAM 1} [get_bd_cells axi_bram_ctrl_15]
create_bd_cell -type ip -vlnv xilinx.com:ip:axi_bram_ctrl:4.0 axi_bram_ctrl_16
set_property -dict {CONFIG.PROTOCOL AXI4LITE CONFIG.SINGLE_PORT_BRAM 1} [get_bd_cells axi_bram_ctrl_16]
create_bd_cell -type ip -vlnv xilinx.com:ip:axi_bram_ctrl:4.0 axi_bram_ctrl_17
set_property -dict {CONFIG.PROTOCOL AXI4LITE CONFIG.SINGLE_PORT_BRAM 1} [get_bd_cells axi_bram_ctrl_17]
create_bd_cell -type ip -vlnv xilinx.com:ip:axi_bram_ctrl:4.0 axi_bram_ctrl_18
set_property -dict {CONFIG.PROTOCOL AXI4LITE CONFIG.SINGLE_PORT_BRAM 1} [get_bd_cells axi_bram_ctrl_18]
create_bd_cell -type ip -vlnv xilinx.com:ip:axi_bram_ctrl:4.0 axi_bram_ctrl_19
set_property -dict {CONFIG.PROTOCOL AXI4LITE CONFIG.SINGLE_PORT_BRAM 1} [get_bd_cells axi_bram_ctrl_19]
create_bd_cell -type ip -vlnv xilinx.com:ip:axi_bram_ctrl:4.0 axi_bram_ctrl_20
set_property -dict {CONFIG.PROTOCOL AXI4LITE CONFIG.SINGLE_PORT_BRAM 1} [get_bd_cells axi_bram_ctrl_20]
create_bd_cell -type ip -vlnv xilinx.com:ip:axi_bram_ctrl:4.0 axi_bram_ctrl_21
set_property -dict {CONFIG.PROTOCOL AXI4LITE CONFIG.SINGLE_PORT_BRAM 1} [get_bd_cells axi_bram_ctrl_21]
create_bd_cell -type ip -vlnv xilinx.com:ip:axi_bram_ctrl:4.0 axi_bram_ctrl_22
set_property -dict {CONFIG.PROTOCOL AXI4LITE CONFIG.SINGLE_PORT_BRAM 1} [get_bd_cells axi_bram_ctrl_22]
create_bd_cell -type ip -vlnv xilinx.com:ip:axi_bram_ctrl:4.0 axi_bram_ctrl_23
set_property -dict {CONFIG.PROTOCOL AXI4LITE CONFIG.SINGLE_PORT_BRAM 1} [get_bd_cells axi_bram_ctrl_23]
create_bd_cell -type ip -vlnv xilinx.com:ip:axi_bram_ctrl:4.0 axi_bram_ctrl_24
set_property -dict {CONFIG.PROTOCOL AXI4LITE CONFIG.SINGLE_PORT_BRAM 1} [get_bd_cells axi_bram_ctrl_24]
create_bd_cell -type ip -vlnv xilinx.com:ip:axi_bram_ctrl:4.0 axi_bram_ctrl_25
set_property -dict {CONFIG.PROTOCOL AXI4LITE CONFIG.SINGLE_PORT_BRAM 1} [get_bd_cells axi_bram_ctrl_25]
create_bd_cell -type ip -vlnv xilinx.com:ip:axi_bram_ctrl:4.0 axi_bram_ctrl_26
set_property -dict {CONFIG.PROTOCOL AXI4LITE CONFIG.SINGLE_PORT_BRAM 1} [get_bd_cells axi_bram_ctrl_26]
create_bd_cell -type ip -vlnv xilinx.com:ip:axi_bram_ctrl:4.0 axi_bram_ctrl_27
set_property -dict {CONFIG.PROTOCOL AXI4LITE CONFIG.SINGLE_PORT_BRAM 1} [get_bd_cells axi_bram_ctrl_27]
create_bd_cell -type ip -vlnv xilinx.com:ip:axi_bram_ctrl:4.0 axi_bram_ctrl_28
set_property -dict {CONFIG.PROTOCOL AXI4LITE CONFIG.SINGLE_PORT_BRAM 1} [get_bd_cells axi_bram_ctrl_28]
create_bd_cell -type ip -vlnv xilinx.com:ip:axi_bram_ctrl:4.0 axi_bram_ctrl_29
set_property -dict {CONFIG.PROTOCOL AXI4LITE CONFIG.SINGLE_PORT_BRAM 1} [get_bd_cells axi_bram_ctrl_29]
create_bd_cell -type ip -vlnv xilinx.com:ip:axi_bram_ctrl:4.0 axi_bram_ctrl_30
set_property -dict {CONFIG.PROTOCOL AXI4LITE CONFIG.SINGLE_PORT_BRAM 1} [get_bd_cells axi_bram_ctrl_30]
create_bd_cell -type ip -vlnv xilinx.com:ip:axi_bram_ctrl:4.0 axi_bram_ctrl_31
set_property -dict {CONFIG.PROTOCOL AXI4LITE CONFIG.SINGLE_PORT_BRAM 1} [get_bd_cells axi_bram_ctrl_31]
create_bd_cell -type ip -vlnv xilinx.com:ip:axi_bram_ctrl:4.0 axi_bram_ctrl_32
set_property -dict {CONFIG.PROTOCOL AXI4LITE CONFIG.SINGLE_PORT_BRAM 1} [get_bd_cells axi_bram_ctrl_32]
create_bd_cell -type ip -vlnv xilinx.com:ip:axi_bram_ctrl:4.0 axi_bram_ctrl_33
set_property -dict {CONFIG.PROTOCOL AXI4LITE CONFIG.SINGLE_PORT_BRAM 1} [get_bd_cells axi_bram_ctrl_33]
create_bd_cell -type ip -vlnv xilinx.com:ip:axi_bram_ctrl:4.0 axi_bram_ctrl_34
set_property -dict {CONFIG.PROTOCOL AXI4LITE CONFIG.SINGLE_PORT_BRAM 1} [get_bd_cells axi_bram_ctrl_34]
create_bd_cell -type ip -vlnv xilinx.com:ip:axi_bram_ctrl:4.0 axi_bram_ctrl_35
set_property -dict {CONFIG.PROTOCOL AXI4LITE CONFIG.SINGLE_PORT_BRAM 1} [get_bd_cells axi_bram_ctrl_35]
create_bd_cell -type ip -vlnv xilinx.com:ip:axi_bram_ctrl:4.0 axi_bram_ctrl_36
set_property -dict {CONFIG.PROTOCOL AXI4LITE CONFIG.SINGLE_PORT_BRAM 1} [get_bd_cells axi_bram_ctrl_36]
create_bd_cell -type ip -vlnv xilinx.com:ip:axi_bram_ctrl:4.0 axi_bram_ctrl_37
set_property -dict {CONFIG.PROTOCOL AXI4LITE CONFIG.SINGLE_PORT_BRAM 1} [get_bd_cells axi_bram_ctrl_37]
create_bd_cell -type ip -vlnv xilinx.com:ip:axi_bram_ctrl:4.0 axi_bram_ctrl_38
set_property -dict {CONFIG.PROTOCOL AXI4LITE CONFIG.SINGLE_PORT_BRAM 1} [get_bd_cells axi_bram_ctrl_38]
create_bd_cell -type ip -vlnv xilinx.com:ip:axi_bram_ctrl:4.0 axi_bram_ctrl_39
set_property -dict {CONFIG.PROTOCOL AXI4LITE CONFIG.SINGLE_PORT_BRAM 1} [get_bd_cells axi_bram_ctrl_39]
create_bd_cell -type ip -vlnv xilinx.com:ip:axi_bram_ctrl:4.0 axi_bram_ctrl_40
set_property -dict {CONFIG.PROTOCOL AXI4LITE CONFIG.SINGLE_PORT_BRAM 1} [get_bd_cells axi_bram_ctrl_40]
create_bd_cell -type ip -vlnv xilinx.com:ip:axi_bram_ctrl:4.0 axi_bram_ctrl_41
set_property -dict {CONFIG.PROTOCOL AXI4LITE CONFIG.SINGLE_PORT_BRAM 1} [get_bd_cells axi_bram_ctrl_41]
create_bd_cell -type ip -vlnv xilinx.com:ip:axi_bram_ctrl:4.0 axi_bram_ctrl_42
set_property -dict {CONFIG.PROTOCOL AXI4LITE CONFIG.SINGLE_PORT_BRAM 1} [get_bd_cells axi_bram_ctrl_42]
create_bd_cell -type ip -vlnv xilinx.com:ip:axi_bram_ctrl:4.0 axi_bram_ctrl_43
set_property -dict {CONFIG.PROTOCOL AXI4LITE CONFIG.SINGLE_PORT_BRAM 1} [get_bd_cells axi_bram_ctrl_43]
create_bd_cell -type ip -vlnv xilinx.com:ip:axi_bram_ctrl:4.0 axi_bram_ctrl_44
set_property -dict {CONFIG.PROTOCOL AXI4LITE CONFIG.SINGLE_PORT_BRAM 1} [get_bd_cells axi_bram_ctrl_44]
create_bd_cell -type ip -vlnv xilinx.com:ip:axi_bram_ctrl:4.0 axi_bram_ctrl_45
set_property -dict {CONFIG.PROTOCOL AXI4LITE CONFIG.SINGLE_PORT_BRAM 1} [get_bd_cells axi_bram_ctrl_45]
create_bd_cell -type ip -vlnv xilinx.com:ip:axi_bram_ctrl:4.0 axi_bram_ctrl_46
set_property -dict {CONFIG.PROTOCOL AXI4LITE CONFIG.SINGLE_PORT_BRAM 1} [get_bd_cells axi_bram_ctrl_46]
create_bd_cell -type ip -vlnv xilinx.com:ip:axi_bram_ctrl:4.0 axi_bram_ctrl_47
set_property -dict {CONFIG.PROTOCOL AXI4LITE CONFIG.SINGLE_PORT_BRAM 1} [get_bd_cells axi_bram_ctrl_47]
create_bd_cell -type ip -vlnv xilinx.com:ip:axi_bram_ctrl:4.0 axi_bram_ctrl_48
set_property -dict {CONFIG.PROTOCOL AXI4LITE CONFIG.SINGLE_PORT_BRAM 1} [get_bd_cells axi_bram_ctrl_48]
create_bd_cell -type ip -vlnv xilinx.com:ip:axi_bram_ctrl:4.0 axi_bram_ctrl_49
set_property -dict {CONFIG.PROTOCOL AXI4LITE CONFIG.SINGLE_PORT_BRAM 1} [get_bd_cells axi_bram_ctrl_49]
create_bd_cell -type ip -vlnv xilinx.com:hls:needlemanWunsch:1.0 needlemanWunsch_0
create_bd_cell -type ip -vlnv xilinx.com:ip:axi_bram_ctrl:4.0 axi_bram_ctrl_results
set_property -dict {CONFIG.PROTOCOL AXI4LITE CONFIG.SINGLE_PORT_BRAM 1} [get_bd_cells axi_bram_ctrl_results]
create_bd_cell -type ip -vlnv xilinx.com:ip:blk_mem_gen:8.2 needlemanWunsch_0_bram_results
set_property -dict [list \
  CONFIG.Memory_Type True_Dual_Port_RAM \
  CONFIG.Enable_B Use_ENB_Pin \
  CONFIG.Use_RSTB_Pin true \
  CONFIG.Port_B_Clock 100 \
  CONFIG.Port_B_Write_Rate 50 \
  CONFIG.Port_B_Enable_Rate 100 \
] [get_bd_cells needlemanWunsch_0_bram_results]

# ---- connections ----

connect_bd_intf_net [get_bd_intf_pins axi_dma_0/M_AXI_MM2S] [get_bd_intf_pins axi_mem_intercon/S00_AXI]
connect_bd_intf_net [get_bd_intf_pins axi_mem_intercon/M00_AXI] [get_bd_intf_pins processing_system7_0/S_AXI_HP0]
connect_bd_intf_net [get_bd_intf_pins processing_system7_0/M_AXI_GP0] [get_bd_intf_pins processing_system7_0_axi_periph/S00_AXI]
connect_bd_intf_net [get_bd_intf_pins processing_system7_0_axi_periph/M00_AXI] [get_bd_intf_pins axi_dma_0/S_AXI_LITE]
connect_bd_intf_net [get_bd_intf_pins axi_dma_0/M_AXIS_MM2S] [get_bd_intf_pins fifo_generator_0/S_AXIS]
connect_bd_intf_net [get_bd_intf_pins fifo_generator_0/M_AXIS] [get_bd_intf_pins axis_dwidth_converter_0/S_AXIS]
connect_bd_intf_net [get_bd_intf_pins axis_dwidth_converter_0/M_AXIS] [get_bd_intf_pins needlemanWunsch_0/ref_genome]
connect_bd_intf_net [get_bd_intf_pins processing_system7_0_axi_periph/M01_AXI] [get_bd_intf_pins needlemanWunsch_0/s_axi_AXILiteS]
connect_bd_intf_net [get_bd_intf_pins needlemanWunsch_0_bram/BRAM_PORTA] [get_bd_intf_pins needlemanWunsch_0/read_r_0_PORTA]
connect_bd_intf_net [get_bd_intf_pins needlemanWunsch_0_bram_0/BRAM_PORTA] [get_bd_intf_pins needlemanWunsch_0/read_r_1_PORTA]
connect_bd_intf_net [get_bd_intf_pins needlemanWunsch_0_bram_1/BRAM_PORTA] [get_bd_intf_pins needlemanWunsch_0/read_r_2_PORTA]
connect_bd_intf_net [get_bd_intf_pins needlemanWunsch_0_bram_2/BRAM_PORTA] [get_bd_intf_pins needlemanWunsch_0/read_r_3_PORTA]
connect_bd_intf_net [get_bd_intf_pins needlemanWunsch_0_bram_3/BRAM_PORTA] [get_bd_intf_pins needlemanWunsch_0/read_r_4_PORTA]
connect_bd_intf_net [get_bd_intf_pins needlemanWunsch_0_bram_4/BRAM_PORTA] [get_bd_intf_pins needlemanWunsch_0/read_r_5_PORTA]
connect_bd_intf_net [get_bd_intf_pins needlemanWunsch_0_bram_5/BRAM_PORTA] [get_bd_intf_pins needlemanWunsch_0/read_r_6_PORTA]
connect_bd_intf_net [get_bd_intf_pins needlemanWunsch_0_bram_6/BRAM_PORTA] [get_bd_intf_pins needlemanWunsch_0/read_r_7_PORTA]
connect_bd_intf_net [get_bd_intf_pins needlemanWunsch_0_bram_7/BRAM_PORTA] [get_bd_intf_pins needlemanWunsch_0/read_r_8_PORTA]
connect_bd_intf_net [get_bd_intf_pins needlemanWunsch_0_bram_8/BRAM_PORTA] [get_bd_intf_pins needlemanWunsch_0/read_r_9_PORTA]
connect_bd_intf_net [get_bd_intf_pins needlemanWunsch_0_bram_9/BRAM_PORTA] [get_bd_intf_pins needlemanWunsch_0/read_r_10_PORTA]
connect_bd_intf_net [get_bd_intf_pins needlemanWunsch_0_bram_10/BRAM_PORTA] [get_bd_intf_pins needlemanWunsch_0/read_r_11_PORTA]
connect_bd_intf_net [get_bd_intf_pins needlemanWunsch_0_bram_11/BRAM_PORTA] [get_bd_intf_pins needlemanWunsch_0/read_r_12_PORTA]
connect_bd_intf_net [get_bd_intf_pins needlemanWunsch_0_bram_12/BRAM_PORTA] [get_bd_intf_pins needlemanWunsch_0/read_r_13_PORTA]
connect_bd_intf_net [get_bd_intf_pins needlemanWunsch_0_bram_13/BRAM_PORTA] [get_bd_intf_pins needlemanWunsch_0/read_r_14_PORTA]
connect_bd_intf_net [get_bd_intf_pins needlemanWunsch_0_bram_14/BRAM_PORTA] [get_bd_intf_pins needlemanWunsch_0/read_r_15_PORTA]
connect_bd_intf_net [get_bd_intf_pins needlemanWunsch_0_bram_15/BRAM_PORTA] [get_bd_intf_pins needlemanWunsch_0/read_r_16_PORTA]
connect_bd_intf_net [get_bd_intf_pins needlemanWunsch_0_bram_16/BRAM_PORTA] [get_bd_intf_pins needlemanWunsch_0/read_r_17_PORTA]
connect_bd_intf_net [get_bd_intf_pins needlemanWunsch_0_bram_17/BRAM_PORTA] [get_bd_intf_pins needlemanWunsch_0/read_r_18_PORTA]
connect_bd_intf_net [get_bd_intf_pins needlemanWunsch_0_bram_18/BRAM_PORTA] [get_bd_intf_pins needlemanWunsch_0/read_r_19_PORTA]
connect_bd_intf_net [get_bd_intf_pins needlemanWunsch_0_bram_19/BRAM_PORTA] [get_bd_intf_pins needlemanWunsch_0/read_r_20_PORTA]
connect_bd_intf_net [get_bd_intf_pins needlemanWunsch_0_bram_20/BRAM_PORTA] [get_bd_intf_pins needlemanWunsch_0/read_r_21_PORTA]
connect_bd_intf_net [get_bd_intf_pins needlemanWunsch_0_bram_21/BRAM_PORTA] [get_bd_intf_pins needlemanWunsch_0/read_r_22_PORTA]
connect_bd_intf_net [get_bd_intf_pins needlemanWunsch_0_bram_22/BRAM_PORTA] [get_bd_intf_pins needlemanWunsch_0/read_r_23_PORTA]
connect_bd_intf_net [get_bd_intf_pins needlemanWunsch_0_bram_23/BRAM_PORTA] [get_bd_intf_pins needlemanWunsch_0/read_r_24_PORTA]
connect_bd_intf_net [get_bd_intf_pins needlemanWunsch_0_bram_24/BRAM_PORTA] [get_bd_intf_pins needlemanWunsch_0/read_r_25_PORTA]
connect_bd_intf_net [get_bd_intf_pins needlemanWunsch_0_bram_25/BRAM_PORTA] [get_bd_intf_pins needlemanWunsch_0/read_r_26_PORTA]
connect_bd_intf_net [get_bd_intf_pins needlemanWunsch_0_bram_26/BRAM_PORTA] [get_bd_intf_pins needlemanWunsch_0/read_r_27_PORTA]
connect_bd_intf_net [get_bd_intf_pins needlemanWunsch_0_bram_27/BRAM_PORTA] [get_bd_intf_pins needlemanWunsch_0/read_r_28_PORTA]
connect_bd_intf_net [get_bd_intf_pins needlemanWunsch_0_bram_28/BRAM_PORTA] [get_bd_intf_pins needlemanWunsch_0/read_r_29_PORTA]
connect_bd_intf_net [get_bd_intf_pins needlemanWunsch_0_bram_29/BRAM_PORTA] [get_bd_intf_pins needlemanWunsch_0/read_r_30_PORTA]
connect_bd_intf_net [get_bd_intf_pins needlemanWunsch_0_bram_30/BRAM_PORTA] [get_bd_intf_pins needlemanWunsch_0/read_r_31_PORTA]
connect_bd_intf_net [get_bd_intf_pins needlemanWunsch_0_bram_31/BRAM_PORTA] [get_bd_intf_pins needlemanWunsch_0/read_r_32_PORTA]
connect_bd_intf_net [get_bd_intf_pins needlemanWunsch_0_bram_32/BRAM_PORTA] [get_bd_intf_pins needlemanWunsch_0/read_r_33_PORTA]
connect_bd_intf_net [get_bd_intf_pins needlemanWunsch_0_bram_33/BRAM_PORTA] [get_bd_intf_pins needlemanWunsch_0/read_r_34_PORTA]
connect_bd_intf_net [get_bd_intf_pins needlemanWunsch_0_bram_34/BRAM_PORTA] [get_bd_intf_pins needlemanWunsch_0/read_r_35_PORTA]
connect_bd_intf_net [get_bd_intf_pins needlemanWunsch_0_bram_35/BRAM_PORTA] [get_bd_intf_pins needlemanWunsch_0/read_r_36_PORTA]
connect_bd_intf_net [get_bd_intf_pins needlemanWunsch_0_bram_36/BRAM_PORTA] [get_bd_intf_pins needlemanWunsch_0/read_r_37_PORTA]
connect_bd_intf_net [get_bd_intf_pins needlemanWunsch_0_bram_37/BRAM_PORTA] [get_bd_intf_pins needlemanWunsch_0/read_r_38_PORTA]
connect_bd_intf_net [get_bd_intf_pins needlemanWunsch_0_bram_38/BRAM_PORTA] [get_bd_intf_pins needlemanWunsch_0/read_r_39_PORTA]
connect_bd_intf_net [get_bd_intf_pins needlemanWunsch_0_bram_39/BRAM_PORTA] [get_bd_intf_pins needlemanWunsch_0/read_r_40_PORTA]
connect_bd_intf_net [get_bd_intf_pins needlemanWunsch_0_bram_40/BRAM_PORTA] [get_bd_intf_pins needlemanWunsch_0/read_r_41_PORTA]
connect_bd_intf_net [get_bd_intf_pins needlemanWunsch_0_bram_41/BRAM_PORTA] [get_bd_intf_pins needlemanWunsch_0/read_r_42_PORTA]
connect_bd_intf_net [get_bd_intf_pins needlemanWunsch_0_bram_42/BRAM_PORTA] [get_bd_intf_pins needlemanWunsch_0/read_r_43_PORTA]
connect_bd_intf_net [get_bd_intf_pins needlemanWunsch_0_bram_43/BRAM_PORTA] [get_bd_intf_pins needlemanWunsch_0/read_r_44_PORTA]
connect_bd_intf_net [get_bd_intf_pins needlemanWunsch_0_bram_44/BRAM_PORTA] [get_bd_intf_pins needlemanWunsch_0/read_r_45_PORTA]
connect_bd_intf_net [get_bd_intf_pins needlemanWunsch_0_bram_45/BRAM_PORTA] [get_bd_intf_pins needlemanWunsch_0/read_r_46_PORTA]
connect_bd_intf_net [get_bd_intf_pins needlemanWunsch_0_bram_46/BRAM_PORTA] [get_bd_intf_pins needlemanWunsch_0/read_r_47_PORTA]
connect_bd_intf_net [get_bd_intf_pins needlemanWunsch_0_bram_47/BRAM_PORTA] [get_bd_intf_pins needlemanWunsch_0/read_r_48_PORTA]
connect_bd_intf_net [get_bd_intf_pins needlemanWunsch_0_bram_48/BRAM_PORTA] [get_bd_intf_pins needlemanWunsch_0/read_r_49_PORTA]
connect_bd_intf_net [get_bd_intf_pins axi_bram_ctrl_0/BRAM_PORTA] [get_bd_intf_pins needlemanWunsch_0_bram/BRAM_PORTB]
connect_bd_intf_net [get_bd_intf_pins axi_bram_ctrl_1/BRAM_PORTA] [get_bd_intf_pins needlemanWunsch_0_bram_0/BRAM_PORTB]
connect_bd_intf_net [get_bd_intf_pins axi_bram_ctrl_2/BRAM_PORTA] [get_bd_intf_pins needlemanWunsch_0_bram_1/BRAM_PORTB]
connect_bd_intf_net [get_bd_intf_pins axi_bram_ctrl_3/BRAM_PORTA] [get_bd_intf_pins needlemanWunsch_0_bram_2/BRAM_PORTB]
connect_bd_intf_net [get_bd_intf_pins axi_bram_ctrl_4/BRAM_PORTA] [get_bd_intf_pins needlemanWunsch_0_bram_3/BRAM_PORTB]
connect_bd_intf_net [get_bd_intf_pins axi_bram_ctrl_5/BRAM_PORTA] [get_bd_intf_pins needlemanWunsch_0_bram_4/BRAM_PORTB]
connect_bd_intf_net [get_bd_intf_pins axi_bram_ctrl_6/BRAM_PORTA] [get_bd_intf_pins needlemanWunsch_0_bram_5/BRAM_PORTB]
connect_bd_intf_net [get_bd_intf_pins axi_bram_ctrl_7/BRAM_PORTA] [get_bd_intf_pins needlemanWunsch_0_bram_6/BRAM_PORTB]
connect_bd_intf_net [get_bd_intf_pins axi_bram_ctrl_8/BRAM_PORTA] [get_bd_intf_pins needlemanWunsch_0_bram_7/BRAM_PORTB]
connect_bd_intf_net [get_bd_intf_pins axi_bram_ctrl_9/BRAM_PORTA] [get_bd_intf_pins needlemanWunsch_0_bram_8/BRAM_PORTB]
connect_bd_intf_net [get_bd_intf_pins axi_bram_ctrl_10/BRAM_PORTA] [get_bd_intf_pins needlemanWunsch_0_bram_9/BRAM_PORTB]
connect_bd_intf_net [get_bd_intf_pins axi_bram_ctrl_11/BRAM_PORTA] [get_bd_intf_pins needlemanWunsch_0_bram_10/BRAM_PORTB]
connect_bd_intf_net [get_bd_intf_pins axi_bram_ctrl_12/BRAM_PORTA] [get_bd_intf_pins needlemanWunsch_0_bram_11/BRAM_PORTB]
connect_bd_intf_net [get_bd_intf_pins axi_bram_ctrl_13/BRAM_PORTA] [get_bd_intf_pins needlemanWunsch_0_bram_12/BRAM_PORTB]
connect_bd_intf_net [get_bd_intf_pins axi_bram_ctrl_14/BRAM_PORTA] [get_bd_intf_pins needlemanWunsch_0_bram_13/BRAM_PORTB]
connect_bd_intf_net [get_bd_intf_pins axi_bram_ctrl_15/BRAM_PORTA] [get_bd_intf_pins needlemanWunsch_0_bram_14/BRAM_PORTB]
connect_bd_intf_net [get_bd_intf_pins axi_bram_ctrl_16/BRAM_PORTA] [get_bd_intf_pins needlemanWunsch_0_bram_15/BRAM_PORTB]
connect_bd_intf_net [get_bd_intf_pins axi_bram_ctrl_17/BRAM_PORTA] [get_bd_intf_pins needlemanWunsch_0_bram_16/BRAM_PORTB]
connect_bd_intf_net [get_bd_intf_pins axi_bram_ctrl_18/BRAM_PORTA] [get_bd_intf_pins needlemanWunsch_0_bram_17/BRAM_PORTB]
connect_bd_intf_net [get_bd_intf_pins axi_bram_ctrl_19/BRAM_PORTA] [get_bd_intf_pins needlemanWunsch_0_bram_18/BRAM_PORTB]
connect_bd_intf_net [get_bd_intf_pins axi_bram_ctrl_20/BRAM_PORTA] [get_bd_intf_pins needlemanWunsch_0_bram_19/BRAM_PORTB]
connect_bd_intf_net [get_bd_intf_pins axi_bram_ctrl_21/BRAM_PORTA] [get_bd_intf_pins needlemanWunsch_0_bram_20/BRAM_PORTB]
connect_bd_intf_net [get_bd_intf_pins axi_bram_ctrl_22/BRAM_PORTA] [get_bd_intf_pins needlemanWunsch_0_bram_21/BRAM_PORTB]
connect_bd_intf_net [get_bd_intf_pins axi_bram_ctrl_23/BRAM_PORTA] [get_bd_intf_pins needlemanWunsch_0_bram_22/BRAM_PORTB]
connect_bd_intf_net [get_bd_intf_pins axi_bram_ctrl_24/BRAM_PORTA] [get_bd_intf_pins needlemanWunsch_0_bram_23/BRAM_PORTB]
connect_bd_intf_net [get_bd_intf_pins axi_bram_ctrl_25/BRAM_PORTA] [get_bd_intf_pins needlemanWunsch_0_bram_24/BRAM_PORTB]
connect_bd_intf_net [get_bd_intf_pins axi_bram_ctrl_26/BRAM_PORTA] [get_bd_intf_pins needlemanWunsch_0_bram_25/BRAM_PORTB]
connect_bd_intf_net [get_bd_intf_pins axi_bram_ctrl_27/BRAM_PORTA] [get_bd_intf_pins needlemanWunsch_0_bram_26/BRAM_PORTB]
connect_bd_intf_net [get_bd_intf_pins axi_bram_ctrl_28/BRAM_PORTA] [get_bd_intf_pins needlemanWunsch_0_bram_27/BRAM_PORTB]
connect_bd_intf_net [get_bd_intf_pins axi_bram_ctrl_29/BRAM_PORTA] [get_bd_intf_pins needlemanWunsch_0_bram_28/BRAM_PORTB]
connect_bd_intf_net [get_bd_intf_pins axi_bram_ctrl_30/BRAM_PORTA] [get_bd_intf_pins needlemanWunsch_0_bram_29/BRAM_PORTB]
connect_bd_intf_net [get_bd_intf_pins axi_bram_ctrl_31/BRAM_PORTA] [get_bd_intf_pins needlemanWunsch_0_bram_30/BRAM_PORTB]
connect_bd_intf_net [get_bd_intf_pins axi_bram_ctrl_32/BRAM_PORTA] [get_bd_intf_pins needlemanWunsch_0_bram_31/BRAM_PORTB]
connect_bd_intf_net [get_bd_intf_pins axi_bram_ctrl_33/BRAM_PORTA] [get_bd_intf_pins needlemanWunsch_0_bram_32/BRAM_PORTB]
connect_bd_intf_net [get_bd_intf_pins axi_bram_ctrl_34/BRAM_PORTA] [get_bd_intf_pins needlemanWunsch_0_bram_33/BRAM_PORTB]
connect_bd_intf_net [get_bd_intf_pins axi_bram_ctrl_35/BRAM_PORTA] [get_bd_intf_pins needlemanWunsch_0_bram_34/BRAM_PORTB]
connect_bd_intf_net [get_bd_intf_pins axi_bram_ctrl_36/BRAM_PORTA] [get_bd_intf_pins needlemanWunsch_0_bram_35/BRAM_PORTB]
connect_bd_intf_net [get_bd_intf_pins axi_bram_ctrl_37/BRAM_PORTA] [get_bd_intf_pins needlemanWunsch_0_bram_36/BRAM_PORTB]
connect_bd_intf_net [get_bd_intf_pins axi_bram_ctrl_38/BRAM_PORTA] [get_bd_intf_pins needlemanWunsch_0_bram_37/BRAM_PORTB]
connect_bd_intf_net [get_bd_intf_pins axi_bram_ctrl_39/BRAM_PORTA] [get_bd_intf_pins needlemanWunsch_0_bram_38/BRAM_PORTB]
connect_bd_intf_net [get_bd_intf_pins axi_bram_ctrl_40/BRAM_PORTA] [get_bd_intf_pins needlemanWunsch_0_bram_39/BRAM_PORTB]
connect_bd_intf_net [get_bd_intf_pins axi_bram_ctrl_41/BRAM_PORTA] [get_bd_intf_pins needlemanWunsch_0_bram_40/BRAM_PORTB]
connect_bd_intf_net [get_bd_intf_pins axi_bram_ctrl_42/BRAM_PORTA] [get_bd_intf_pins needlemanWunsch_0_bram_41/BRAM_PORTB]
connect_bd_intf_net [get_bd_intf_pins axi_bram_ctrl_43/BRAM_PORTA] [get_bd_intf_pins needlemanWunsch_0_bram_42/BRAM_PORTB]
connect_bd_intf_net [get_bd_intf_pins axi_bram_ctrl_44/BRAM_PORTA] [get_bd_intf_pins needlemanWunsch_0_bram_43/BRAM_PORTB]
connect_bd_intf_net [get_bd_intf_pins axi_bram_ctrl_45/BRAM_PORTA] [get_bd_intf_pins needlemanWunsch_0_bram_44/BRAM_PORTB]
connect_bd_intf_net [get_bd_intf_pins axi_bram_ctrl_46/BRAM_PORTA] [get_bd_intf_pins needlemanWunsch_0_bram_45/BRAM_PORTB]
connect_bd_intf_net [get_bd_intf_pins axi_bram_ctrl_47/BRAM_PORTA] [get_bd_intf_pins needlemanWunsch_0_bram_46/BRAM_PORTB]
connect_bd_intf_net [get_bd_intf_pins axi_bram_ctrl_48/BRAM_PORTA] [get_bd_intf_pins needlemanWunsch_0_bram_47/BRAM_PORTB]
connect_bd_intf_net [get_bd_intf_pins axi_bram_ctrl_49/BRAM_PORTA] [get_bd_intf_pins needlemanWunsch_0_bram_48/BRAM_PORTB]
connect_bd_intf_net [get_bd_intf_pins processing_system7_0_axi_periph/M02_AXI] [get_bd_intf_pins axi_bram_ctrl_0/S_AXI]
connect_bd_intf_net [get_bd_intf_pins processing_system7_0_axi_periph/M03_AXI] [get_bd_intf_pins axi_bram_ctrl_1/S_AXI]
connect_bd_intf_net [get_bd_intf_pins processing_system7_0_axi_periph/M04_AXI] [get_bd_intf_pins axi_bram_ctrl_2/S_AXI]
connect_bd_intf_net [get_bd_intf_pins processing_system7_0_axi_periph/M05_AXI] [get_bd_intf_pins axi_bram_ctrl_3/S_AXI]
connect_bd_intf_net [get_bd_intf_pins processing_system7_0_axi_periph/M06_AXI] [get_bd_intf_pins axi_bram_ctrl_4/S_AXI]
connect_bd_intf_net [get_bd_intf_pins processing_system7_0_axi_periph/M07_AXI] [get_bd_intf_pins axi_bram_ctrl_5/S_AXI]
connect_bd_intf_net [get_bd_intf_pins processing_system7_0_axi_periph/M08_AXI] [get_bd_intf_pins axi_bram_ctrl_6/S_AXI]
connect_bd_intf_net [get_bd_intf_pins processing_system7_0_axi_periph/M09_AXI] [get_bd_intf_pins axi_bram_ctrl_7/S_AXI]
connect_bd_intf_net [get_bd_intf_pins processing_system7_0_axi_periph/M10_AXI] [get_bd_intf_pins axi_bram_ctrl_8/S_AXI]
connect_bd_intf_net [get_bd_intf_pins processing_system7_0_axi_periph/M11_AXI] [get_bd_intf_pins axi_bram_ctrl_9/S_AXI]
connect_bd_intf_net [get_bd_intf_pins processing_system7_0_axi_periph/M12_AXI] [get_bd_intf_pins axi_bram_ctrl_10/S_AXI]
connect_bd_intf_net [get_bd_intf_pins processing_system7_0_axi_periph/M13_AXI] [get_bd_intf_pins axi_bram_ctrl_11/S_AXI]
connect_bd_intf_net [get_bd_intf_pins processing_system7_0_axi_periph/M14_AXI] [get_bd_intf_pins axi_bram_ctrl_12/S_AXI]
connect_bd_intf_net [get_bd_intf_pins processing_system7_0_axi_periph/M15_AXI] [get_bd_intf_pins axi_bram_ctrl_13/S_AXI]
connect_bd_intf_net [get_bd_intf_pins processing_system7_0_axi_periph/M16_AXI] [get_bd_intf_pins axi_bram_ctrl_14/S_AXI]
connect_bd_intf_net [get_bd_intf_pins processing_system7_0_axi_periph/M17_AXI] [get_bd_intf_pins axi_bram_ctrl_15/S_AXI]
connect_bd_intf_net [get_bd_intf_pins processing_system7_0_axi_periph/M18_AXI] [get_bd_intf_pins axi_bram_ctrl_16/S_AXI]
connect_bd_intf_net [get_bd_intf_pins processing_system7_0_axi_periph/M19_AXI] [get_bd_intf_pins axi_bram_ctrl_17/S_AXI]
connect_bd_intf_net [get_bd_intf_pins processing_system7_0_axi_periph/M20_AXI] [get_bd_intf_pins axi_bram_ctrl_18/S_AXI]
connect_bd_intf_net [get_bd_intf_pins processing_system7_0_axi_periph/M21_AXI] [get_bd_intf_pins axi_bram_ctrl_19/S_AXI]
connect_bd_intf_net [get_bd_intf_pins processing_system7_0_axi_periph/M22_AXI] [get_bd_intf_pins axi_bram_ctrl_20/S_AXI]
connect_bd_intf_net [get_bd_intf_pins processing_system7_0_axi_periph/M23_AXI] [get_bd_intf_pins axi_bram_ctrl_21/S_AXI]
connect_bd_intf_net [get_bd_intf_pins processing_system7_0_axi_periph/M24_AXI] [get_bd_intf_pins axi_bram_ctrl_22/S_AXI]
connect_bd_intf_net [get_bd_intf_pins processing_system7_0_axi_periph/M25_AXI] [get_bd_intf_pins axi_bram_ctrl_23/S_AXI]
connect_bd_intf_net [get_bd_intf_pins processing_system7_0_axi_periph/M26_AXI] [get_bd_intf_pins axi_bram_ctrl_24/S_AXI]
connect_bd_intf_net [get_bd_intf_pins processing_system7_0_axi_periph/M27_AXI] [get_bd_intf_pins axi_bram_ctrl_25/S_AXI]
connect_bd_intf_net [get_bd_intf_pins processing_system7_0_axi_periph/M28_AXI] [get_bd_intf_pins axi_bram_ctrl_26/S_AXI]
connect_bd_intf_net [get_bd_intf_pins processing_system7_0_axi_periph/M29_AXI] [get_bd_intf_pins axi_bram_ctrl_27/S_AXI]
connect_bd_intf_net [get_bd_intf_pins processing_system7_0_axi_periph/M30_AXI] [get_bd_intf_pins axi_bram_ctrl_28/S_AXI]
connect_bd_intf_net [get_bd_intf_pins processing_system7_0_axi_periph/M31_AXI] [get_bd_intf_pins axi_bram_ctrl_29/S_AXI]
connect_bd_intf_net [get_bd_intf_pins processing_system7_0_axi_periph/M32_AXI] [get_bd_intf_pins axi_bram_ctrl_30/S_AXI]
connect_bd_intf_net [get_bd_intf_pins processing_system7_0_axi_periph/M33_AXI] [get_bd_intf_pins axi_bram_ctrl_31/S_AXI]
connect_bd_intf_net [get_bd_intf_pins processing_system7_0_axi_periph/M34_AXI] [get_bd_intf_pins axi_bram_ctrl_32/S_AXI]
connect_bd_intf_net [get_bd_intf_pins processing_system7_0_axi_periph/M35_AXI] [get_bd_intf_pins axi_bram_ctrl_33/S_AXI]
connect_bd_intf_net [get_bd_intf_pins processing_system7_0_axi_periph/M36_AXI] [get_bd_intf_pins axi_bram_ctrl_34/S_AXI]
connect_bd_intf_net [get_bd_intf_pins processing_system7_0_axi_periph/M37_AXI] [get_bd_intf_pins axi_bram_ctrl_35/S_AXI]
connect_bd_intf_net [get_bd_intf_pins processing_system7_0_axi_periph/M38_AXI] [get_bd_intf_pins axi_bram_ctrl_36/S_AXI]
connect_bd_intf_net [get_bd_intf_pins processing_system7_0_axi_periph/M39_AXI] [get_bd_intf_pins axi_bram_ctrl_37/S_AXI]
connect_bd_intf_net [get_bd_intf_pins processing_system7_0_axi_periph/M40_AXI] [get_bd_intf_pins axi_bram_ctrl_38/S_AXI]
connect_bd_intf_net [get_bd_intf_pins processing_system7_0_axi_periph/M41_AXI] [get_bd_intf_pins axi_bram_ctrl_39/S_AXI]
connect_bd_intf_net [get_bd_intf_pins processing_system7_0_axi_periph/M42_AXI] [get_bd_intf_pins axi_bram_ctrl_40/S_AXI]
connect_bd_intf_net [get_bd_intf_pins processing_system7_0_axi_periph/M43_AXI] [get_bd_intf_pins axi_bram_ctrl_41/S_AXI]
connect_bd_intf_net [get_bd_intf_pins processing_system7_0_axi_periph/M44_AXI] [get_bd_intf_pins axi_bram_ctrl_42/S_AXI]
connect_bd_intf_net [get_bd_intf_pins processing_system7_0_axi_periph/M45_AXI] [get_bd_intf_pins axi_bram_ctrl_43/S_AXI]
connect_bd_intf_net [get_bd_intf_pins processing_system7_0_axi_periph/M46_AXI] [get_bd_intf_pins axi_bram_ctrl_44/S_AXI]
connect_bd_intf_net [get_bd_intf_pins processing_system7_0_axi_periph/M47_AXI] [get_bd_intf_pins axi_bram_ctrl_45/S_AXI]
connect_bd_intf_net [get_bd_intf_pins processing_system7_0_axi_periph/M48_AXI] [get_bd_intf_pins axi_bram_ctrl_46/S_AXI]
connect_bd_intf_net [get_bd_intf_pins processing_system7_0_axi_periph/M49_AXI] [get_bd_intf_pins axi_bram_ctrl_47/S_AXI]
connect_bd_intf_net [get_bd_intf_pins processing_system7_0_axi_periph/M50_AXI] [get_bd_intf_pins axi_bram_ctrl_48/S_AXI]
connect_bd_intf_net [get_bd_intf_pins processing_system7_0_axi_periph/M51_AXI] [get_bd_intf_pins axi_bram_ctrl_49/S_AXI]
connect_bd_intf_net [get_bd_intf_pins needlemanWunsch_0_bram_results/BRAM_PORTA] [get_bd_intf_pins needlemanWunsch_0/results_PORTA]
connect_bd_intf_net [get_bd_intf_pins processing_system7_0_axi_periph/M52_AXI] [get_bd_intf_pins axi_bram_ctrl_results/S_AXI]
